# EAGLE design AllSerial (EAGLE 7.6.0)

## Sheet 1 of 6
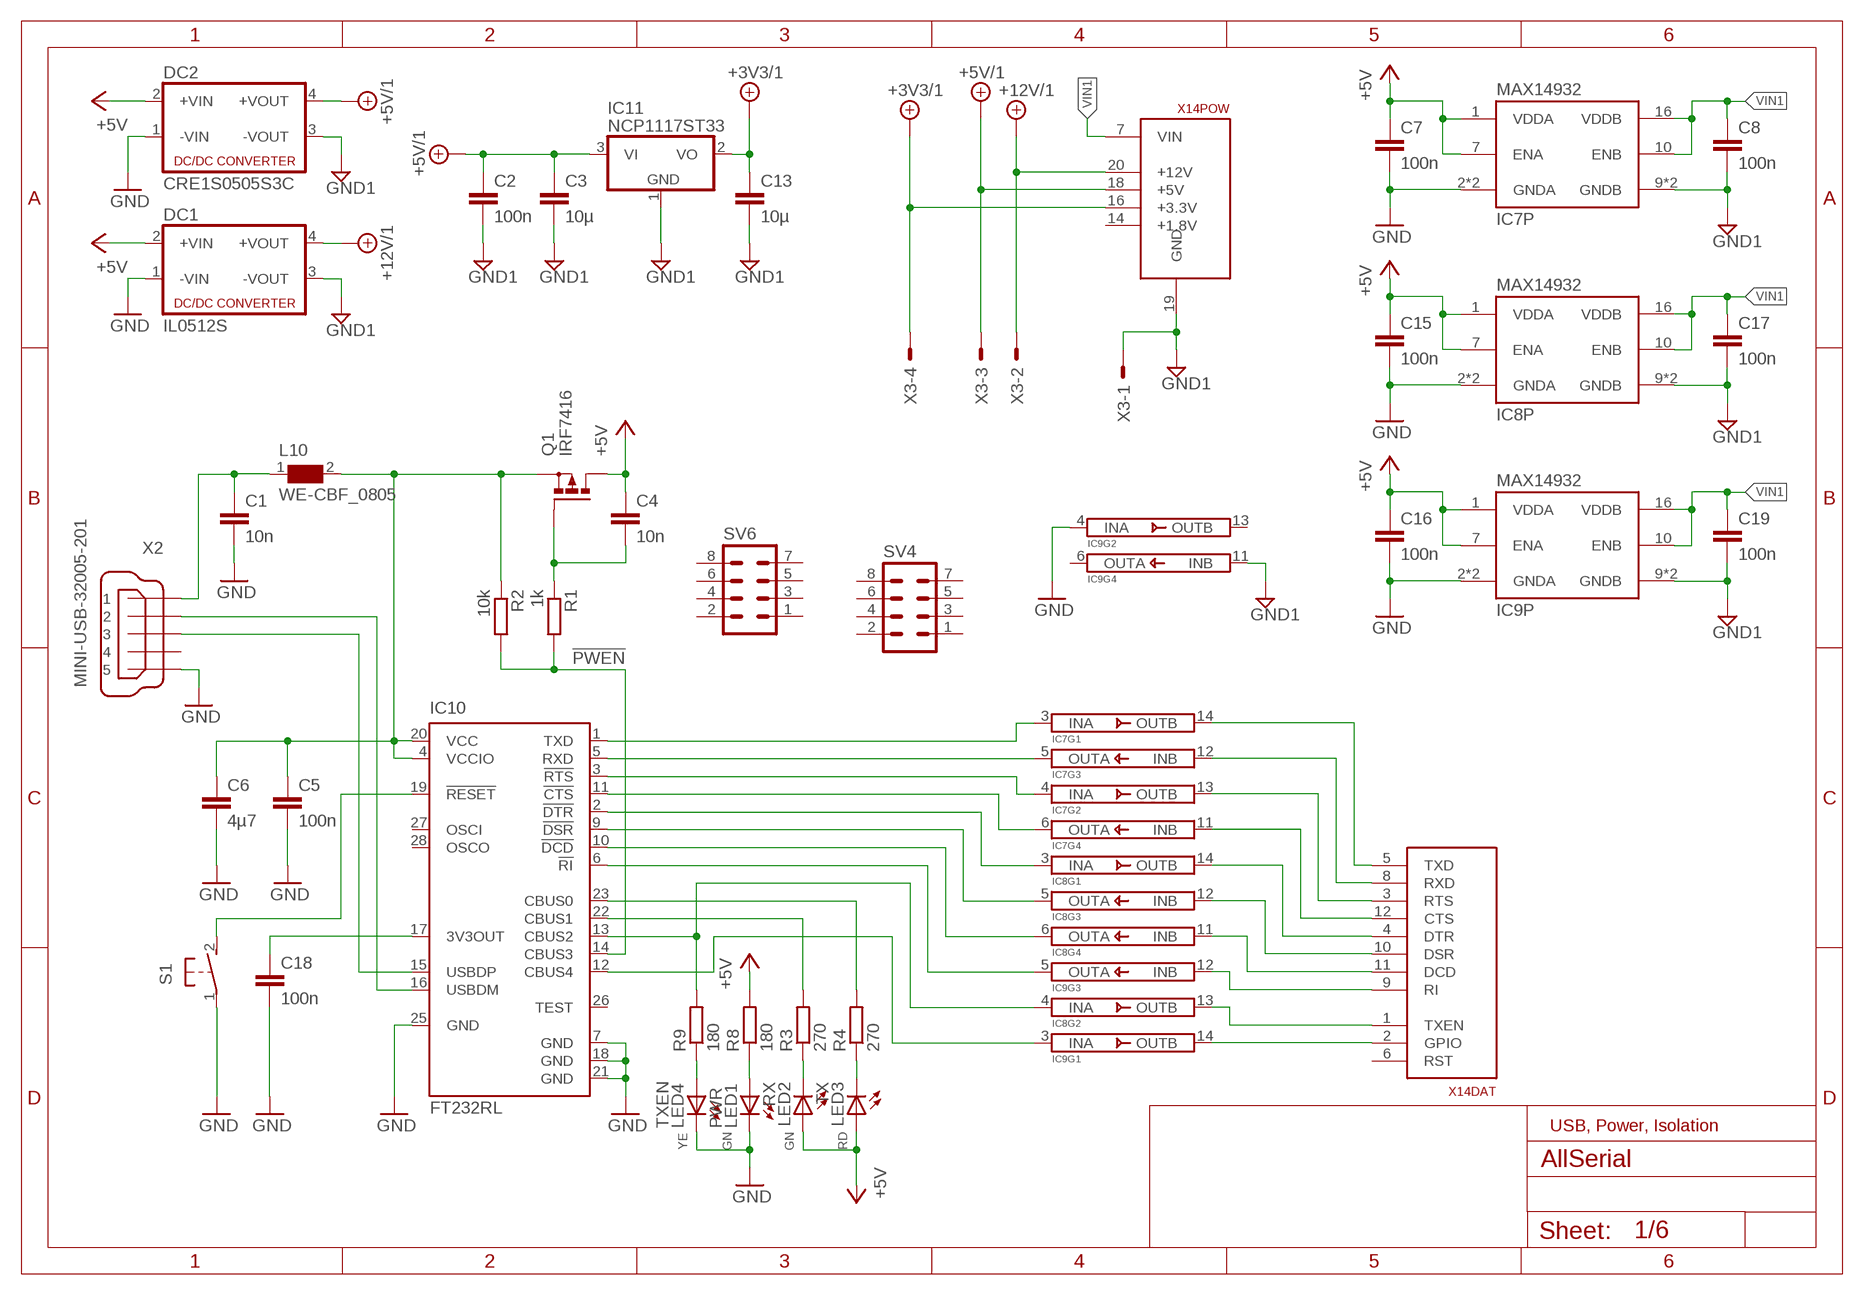
[diagram p0: schematic, sheet 1]

### Parts
C1  10n  C-EUC0805  [C0805]
C2  100n  C-EUC0805  [C0805]
C3  10µ  C-EUC0805  [C0805]
C4  10n  C-EUC0805  [C0805]
C5  100n  C-EUC0805  [C0805]
C6  4µ7  C-EUC0805  [C0805]
C7  100n  C-EUC0805  [C0805]
C8  100n  C-EUC0805  [C0805]
C13  10µ  C-EUC0805  [C0805]
C15  100n  C-EUC0805  [C0805]
C16  100n  C-EUC0805  [C0805]
C17  100n  C-EUC0805  [C0805]
C18  100n  C-EUC0805  [C0805]
C19  100n  C-EUC0805  [C0805]
DC1  IL0512S  NME  [NME]
DC2  CRE1S0505S3C  NME  [NME]
IC7  MAX14932  [SO16]
IC8  MAX14932  [SO16]
IC9  MAX14932  [SO16]
IC10  FT232RL  [SSOP28]
IC11  NCP1117ST33  MCP1703CB  [SOT23]
L10  WE-CBF_0805  [0805]
LED1  PWR  LEDCHIPLED_0805  [CHIPLED_0805]
LED2  RX  LEDCHIPLED_0805  [CHIPLED_0805]
LED3  TX  LEDCHIPLED_0805  [CHIPLED_0805]
LED4  TXEN  LEDCHIPLED_0805  [CHIPLED_0805]
Q1  IRF7416  P-MOSFET-SO8  [SO-08]
R1  1k  R-EU_R0805  [R0805]
R2  10k  R-EU_R0805  [R0805]
R3  270  R-EU_R0805  [R0805]
R4  270  R-EU_R0805  [R0805]
R8  180  R-EU_R0805  [R0805]
R9  180  R-EU_R0805  [R0805]
S1  31-XX  [B3F-31XX]
SV4  MA04-2  [MA04-2]
SV6  MA04-2  [MA04-2]
X2  MINI-USB-32005-201  [32005-201]
X3  AKL18X-04W  [AKL182-04]
X14  ALLSERIALMM  [MAIN-THT]

### Nets
!PWEN: IC10.14(CBUS3) R1.2 R2.2
+3V3/1: C13.1 IC11.2(VO) X3.P$4 X14.16(POW:+3.3V)
+5V: C4.1 C7.1 C15.1 C16.1 DC1.2(+VIN) DC2.2(+VIN) IC7.1(P:VDDA) IC7.7(P:ENA) IC8.1(P:VDDA) IC8.7(P:ENA) IC9.1(P:VDDA) IC9.7(P:ENA) LED2.A LED3.A Q1.5(D) Q1.6(D) Q1.7(D) Q1.8(D) R8.2
+5V/1: C2.1 C3.1 DC2.4(+VOUT) IC11.3(VI) X3.P$3 X14.18(POW:+5V)
+12V/1: DC1.4(+VOUT) X3.P$2 X14.20(POW:+12V)
GND: C1.2 C5.2 C6.2 C7.2 C15.2 C16.2 C18.2 DC1.1(-VIN) DC2.1(-VIN) IC7.2(P:GNDA) IC7.8(P:GNDA) IC8.2(P:GNDA) IC8.8(P:GNDA) IC9.2(P:GNDA) IC9.4(INA) IC9.8(P:GNDA) IC10.7(GND) IC10.18(GND) IC10.21(GND) IC10.25(GND) LED1.C LED4.C S1.1(P) X2.5
GND1: C2.2 C3.2 C8.2 C13.2 C17.2 C19.2 DC1.3(-VOUT) DC2.3(-VOUT) IC7.9(P:GNDB) IC7.15(P:GNDB) IC8.9(P:GNDB) IC8.15(P:GNDB) IC9.9(P:GNDB) IC9.11(INB) IC9.15(P:GNDB) IC11.1(GND) X3.P$1 X14.19(POW:GND)
N$3: IC8.4(INA) IC10.13(CBUS2) R9.2
N$4: LED3.C R4.1
N$5: IC10.19(!RESET) S1.2(S)
N$6: LED2.C R3.1
N$7: LED4.A R9.1
N$8: LED1.A R8.1
N$11: C1.1 L10.1 X2.1
N$13: IC9.3(INA) IC10.12(CBUS4)
N$14: IC7.3(INA) IC10.1(TXD)
N$19: IC10.16(USBDM) X2.2
N$20: IC7.5(OUTA) IC10.5(RXD)
N$21: IC10.15(USBDP) X2.3
N$22: C18.1 IC10.17(3V3OUT)
N$29: IC7.4(INA) IC10.3(!RTS)
N$32: IC7.6(OUTA) IC10.11(!CTS)
N$33: IC8.3(INA) IC10.2(!DTR)
N$34: IC8.5(OUTA) IC10.9(!DSR)
N$35: IC8.6(OUTA) IC10.10(!DCD)
N$36: IC9.5(OUTA) IC10.6(!RI)
N$38: C5.1 C6.1 IC10.4(VCCIO) IC10.20(VCC) L10.2 Q1.1(S) Q1.2(S) Q1.3(S) R2.1
N$42: C4.2 Q1.4(G) R1.1
N$80: IC7.14(OUTB) X14.5(DAT:TXD)
N$81: IC7.12(INB) X14.8(DAT:RXD)
N$82: IC7.13(OUTB) X14.3(DAT:RTS)
N$83: IC7.11(INB) X14.12(DAT:CTS)
N$84: IC8.14(OUTB) X14.4(DAT:DTR)
N$85: IC8.12(INB) X14.10(DAT:DSR)
N$86: IC8.11(INB) X14.11(DAT:DCD)
N$87: IC9.12(INB) X14.9(DAT:RI)
N$88: IC8.13(OUTB) X14.1(DAT:TXEN)
N$89: IC9.14(OUTB) X14.2(DAT:GPIO)
RXLED: IC10.22(CBUS1) R3.2
TXLED: IC10.23(CBUS0) R4.2
VIN1: C8.1 C17.1 C19.1 IC7.10(P:ENB) IC7.16(P:VDDB) IC8.10(P:ENB) IC8.16(P:VDDB) IC9.10(P:ENB) IC9.16(P:VDDB) X14.7(POW:VIN)
Unconnected: IC9.6(OUTA) IC9.13(OUTB) IC10.26(TEST) IC10.27(OSCI) IC10.28(OSCO) SV4.1 SV4.2 SV4.3 SV4.4 SV4.5 SV4.6 SV4.7 SV4.8 SV6.1 SV6.2 SV6.3 SV6.4 SV6.5 SV6.6 SV6.7 SV6.8 X2.4 X14.6(DAT:RST) X14.14(POW:+1.8V)

### Notes on the sheet
- USB, Power, Isolation

## Sheet 2 of 6
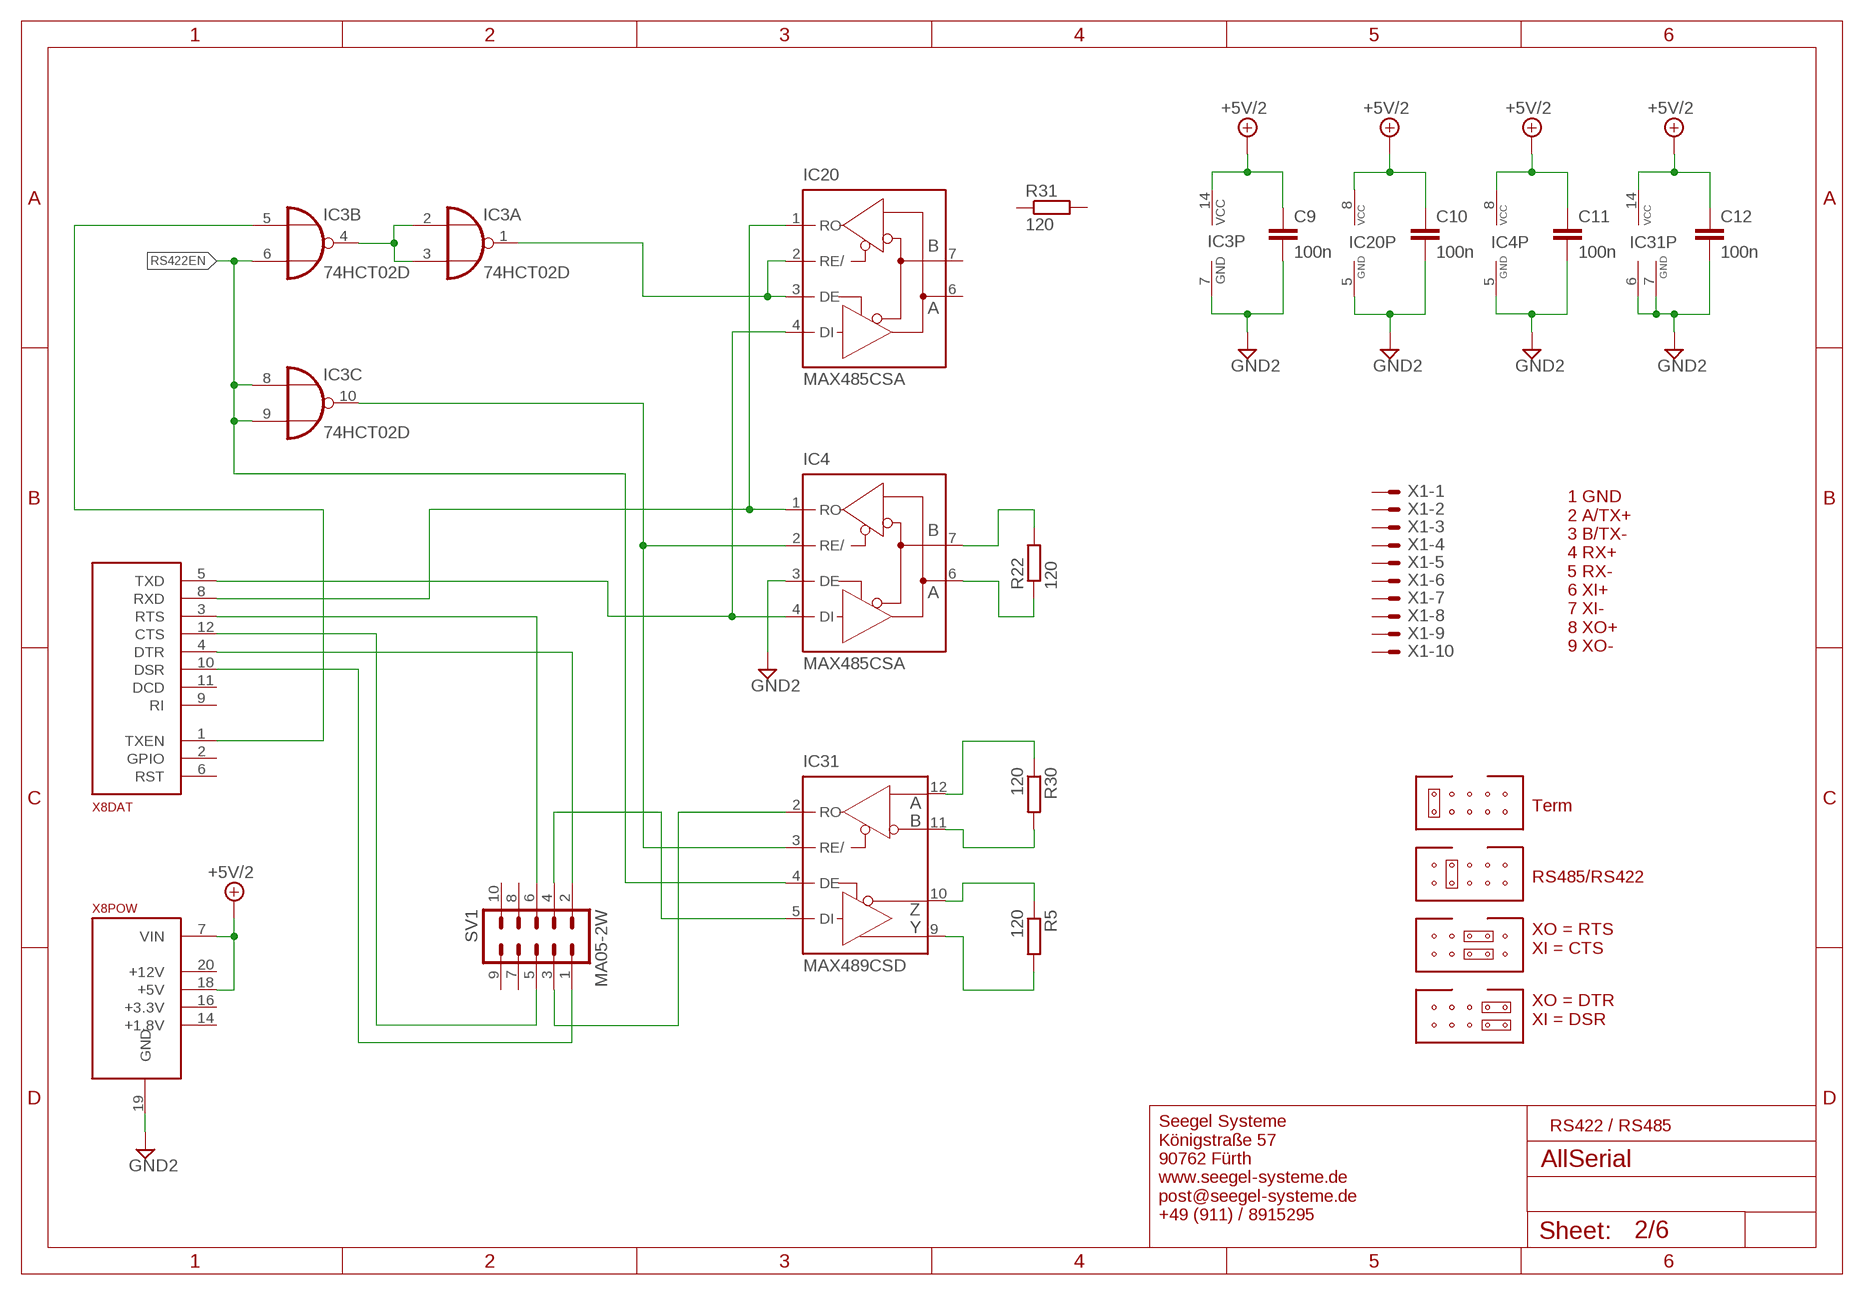
[diagram p1: schematic, sheet 2]

### Parts
C9  100n  C-EUC0805  [C0805]
C10  100n  C-EUC0805  [C0805]
C11  100n  C-EUC0805  [C0805]
C12  100n  C-EUC0805  [C0805]
IC3  74HCT02D  [SO14]
IC4  MAX485CSA  MAX481CSA  [SO08]
IC20  MAX485CSA  MAX481CSA  [SO08]
IC31  MAX489CSD  [SO14]
R5  120  R-EU_R0805  [R0805]
R22  120  R-EU_R0805  [R0805]
R30  120  R-EU_R0805  [R0805]
R31  120  R-EU_R0805  [R0805]
SV1  MA05-2W  [MA05-2W]
X1  AKL18X-10W  [AKL182-10]
X8  ALLSERIALD  [DAUGHTER-THT]

### Nets
+5V/2: C9.1 C10.1 C11.1 C12.1 IC3.14(P:VCC) IC4.8(VCC) IC20.8(VCC) IC31.14(VCC) X8.7(POW:VIN) X8.18(POW:+5V)
GND2: C9.2 C10.2 C11.2 C12.2 IC3.7(P:GND) IC4.3(DE) IC4.5(GND) IC20.5(GND) IC31.6(GND) IC31.7(GND) X8.19(POW:GND)
N$1: IC31.11(B) R30.2
N$2: IC31.10(Z) R5.1
N$10: IC31.9(Y) R5.2
N$37: IC3.5(B:I0) X8.1(DAT:TXEN)
N$39: IC31.12(A) R30.1
N$40: SV1.5 X8.12(DAT:CTS)
N$41: IC4.7(B) R22.2
N$43: IC4.6(A) R22.1
N$48: IC3.2(A:I0) IC3.3(A:I1) IC3.4(B:O)
N$50: IC3.1(A:O) IC20.2(RE/) IC20.3(DE)
N$51: IC3.10(C:O) IC4.2(RE/) IC31.3(RE/)
N$52: IC4.1(RO) IC20.1(RO) X8.8(DAT:RXD)
N$53: IC4.4(DI) IC20.4(DI) X8.5(DAT:TXD)
N$66: SV1.6 X8.3(DAT:RTS)
N$67: SV1.2 X8.4(DAT:DTR)
N$68: IC31.5(DI) SV1.4
N$69: IC31.2(RO) SV1.3
N$70: SV1.1 X8.10(DAT:DSR)
RS422EN: IC3.6(B:I1) IC3.8(C:I0) IC3.9(C:I1) IC31.4(DE)
Unconnected: IC3.11(D:I0) IC3.12(D:I1) IC3.13(D:O) IC20.6(A) IC20.7(B) IC31.1(NC) IC31.8(NC) IC31.13(NC) R31.1 R31.2 SV1.7 SV1.8 SV1.9 SV1.10 X1.P$1 X1.P$2 X1.P$3 X1.P$4 X1.P$5 X1.P$6 X1.P$7 X1.P$8 X1.P$9 X1.P$10 X8.2(DAT:GPIO) X8.6(DAT:RST) X8.9(DAT:RI) X8.11(DAT:DCD) X8.14(POW:+1.8V) X8.16(POW:+3.3V) X8.20(POW:+12V)

### Notes on the sheet
- 1 GND
  2 A/TX+
  3 B/TX-
  4 RX+
  5 RX-
  6 XI+
  7 XI-
  8 XO+
  9 XO-
- Term
- RS485/RS422
- XO = RTS
  XI = CTS
- XO = DTR
  XI = DSR
- RS422 / RS485
- Seegel Systeme
  Königstraße 57
  90762 Fürth
  www.seegel-systeme.de
  post@seegel-systeme.de
  +49 (911) / 8915295

## Sheet 3 of 6
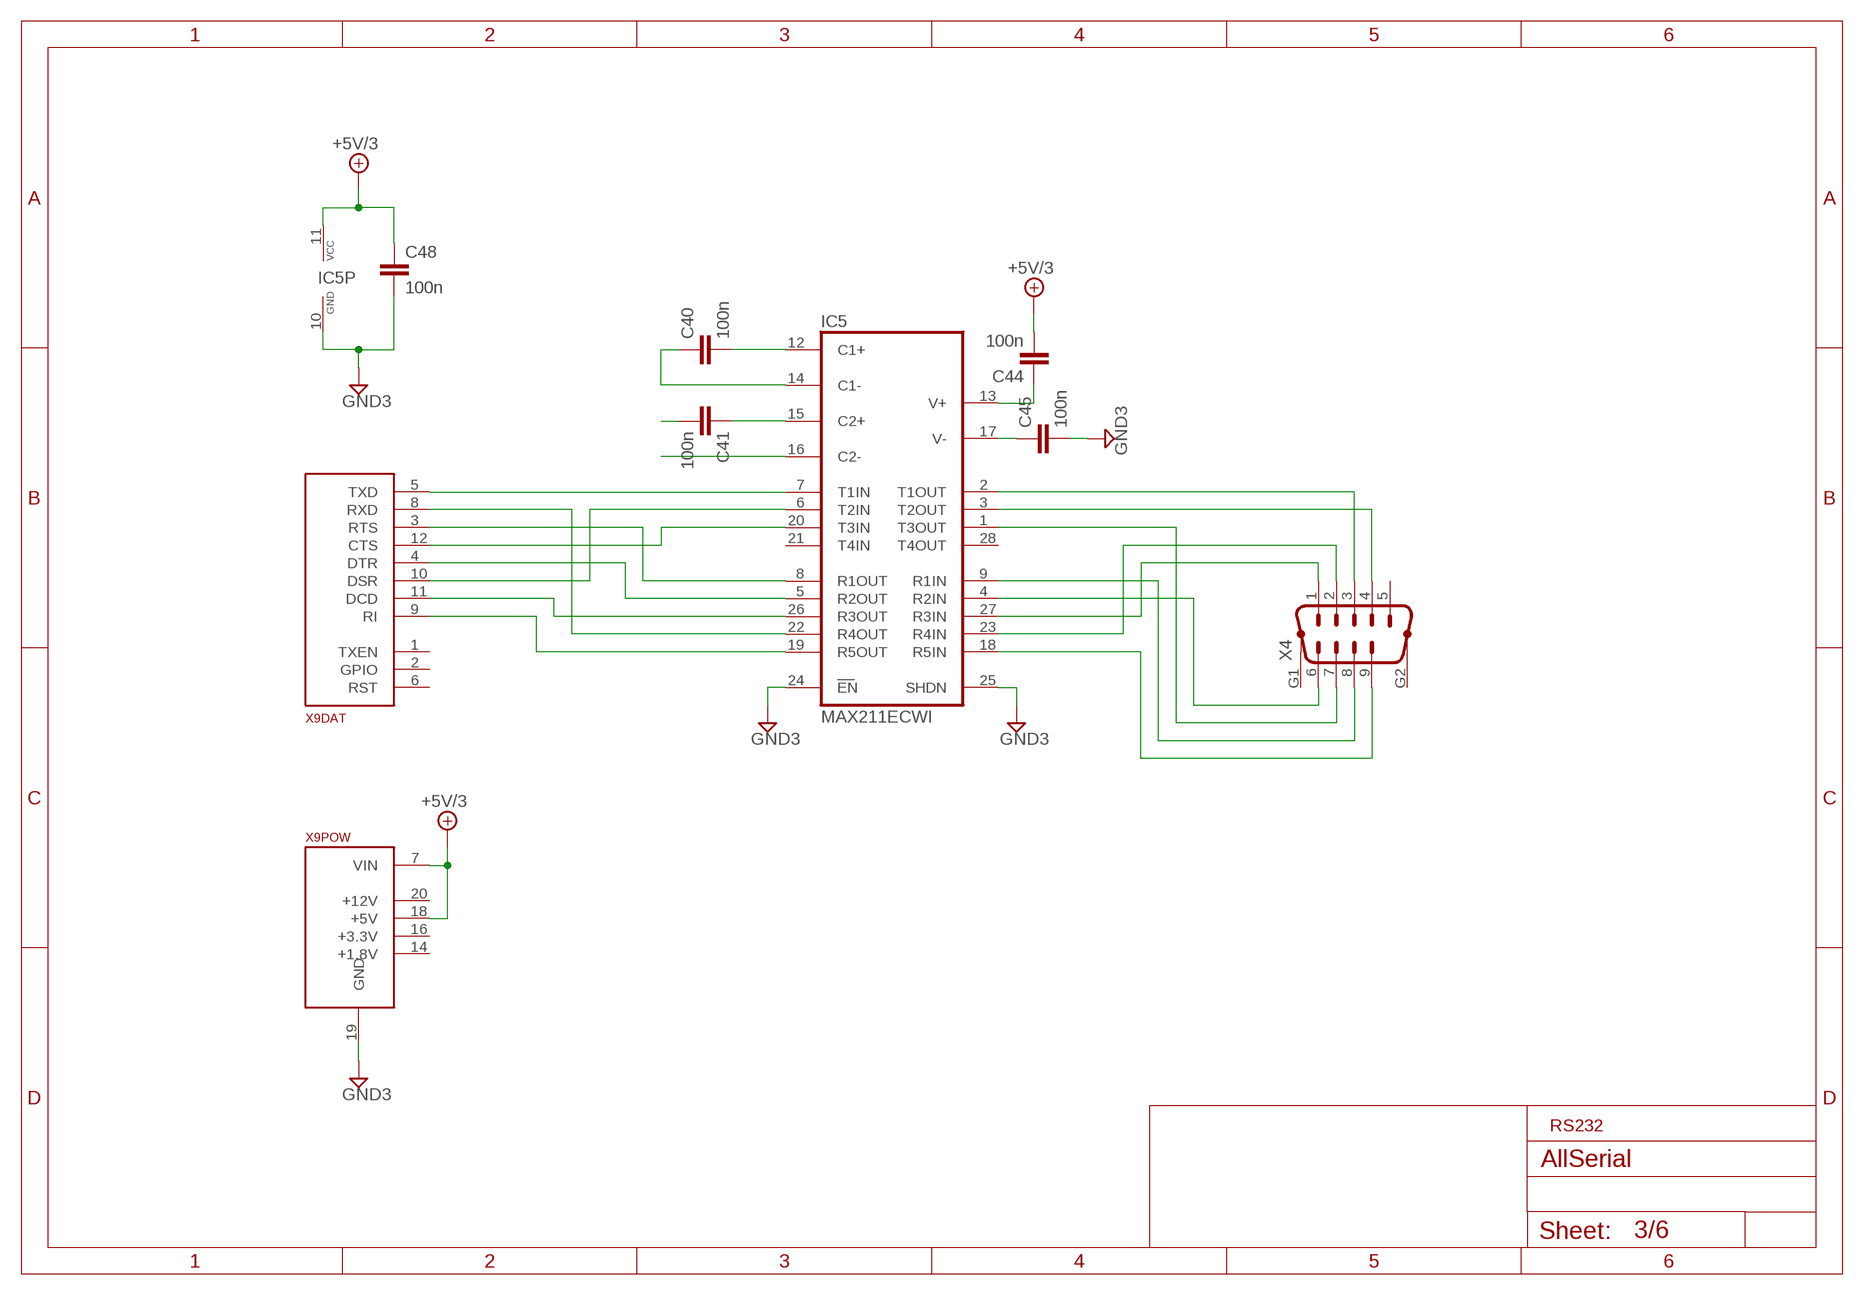
[diagram p2: schematic, sheet 3]

### Parts
C40  100n  C-EUC0805  [C0805]
C41  100n  C-EUC0805  [C0805]
C44  100n  C-EUC0805  [C0805]
C45  100n  C-EUC0805  [C0805]
C48  100n  C-EUC0805  [C0805]
IC5  MAX211ECWI  [SO28L]
X4  M09HP  [M09HP]
X9  ALLSERIALD  [DAUGHTER-THT]

### Nets
+5V/3: C44.2 C48.1 IC5.11(VCC) X9.7(POW:VIN) X9.18(POW:+5V)
GND3: C45.2 C48.2 IC5.10(GND) IC5.24(EN) IC5.25(SHDN) X9.19(POW:GND)
N$9: IC5.18(R5IN) X4.9
N$12: IC5.9(R1IN) X4.8
N$15: IC5.1(T3OUT) X4.7
N$16: IC5.4(R2IN) X4.6
N$17: IC5.27(R3IN) X4.1
N$18: IC5.23(R4IN) X4.2
N$23: IC5.2(T1OUT) X4.3
N$24: IC5.3(T2OUT) X4.4
N$25: C40.2 IC5.12(C1+)
N$26: C40.1 IC5.14(C1-)
N$27: C41.1 IC5.15(C2+)
N$28: IC5.16(C2-)
N$30: C45.1 IC5.17(V-)
N$31: C44.1 IC5.13(V+)
N$92: C41.2
N$93: IC5.7(T1IN) X9.5(DAT:TXD)
N$94: IC5.22(R4OUT) X9.8(DAT:RXD)
N$95: IC5.20(T3IN) X9.12(DAT:CTS)
N$96: IC5.8(R1OUT) X9.3(DAT:RTS)
N$97: IC5.26(R3OUT) X9.11(DAT:DCD)
N$98: IC5.19(R5OUT) X9.9(DAT:RI)
N$99: IC5.5(R2OUT) X9.4(DAT:DTR)
N$100: IC5.6(T2IN) X9.10(DAT:DSR)
Unconnected: IC5.21(T4IN) IC5.28(T4OUT) X4.5 X4.G1 X4.G2 X9.1(DAT:TXEN) X9.2(DAT:GPIO) X9.6(DAT:RST) X9.14(POW:+1.8V) X9.16(POW:+3.3V) X9.20(POW:+12V)

### Notes on the sheet
- RS232

## Sheet 4 of 6
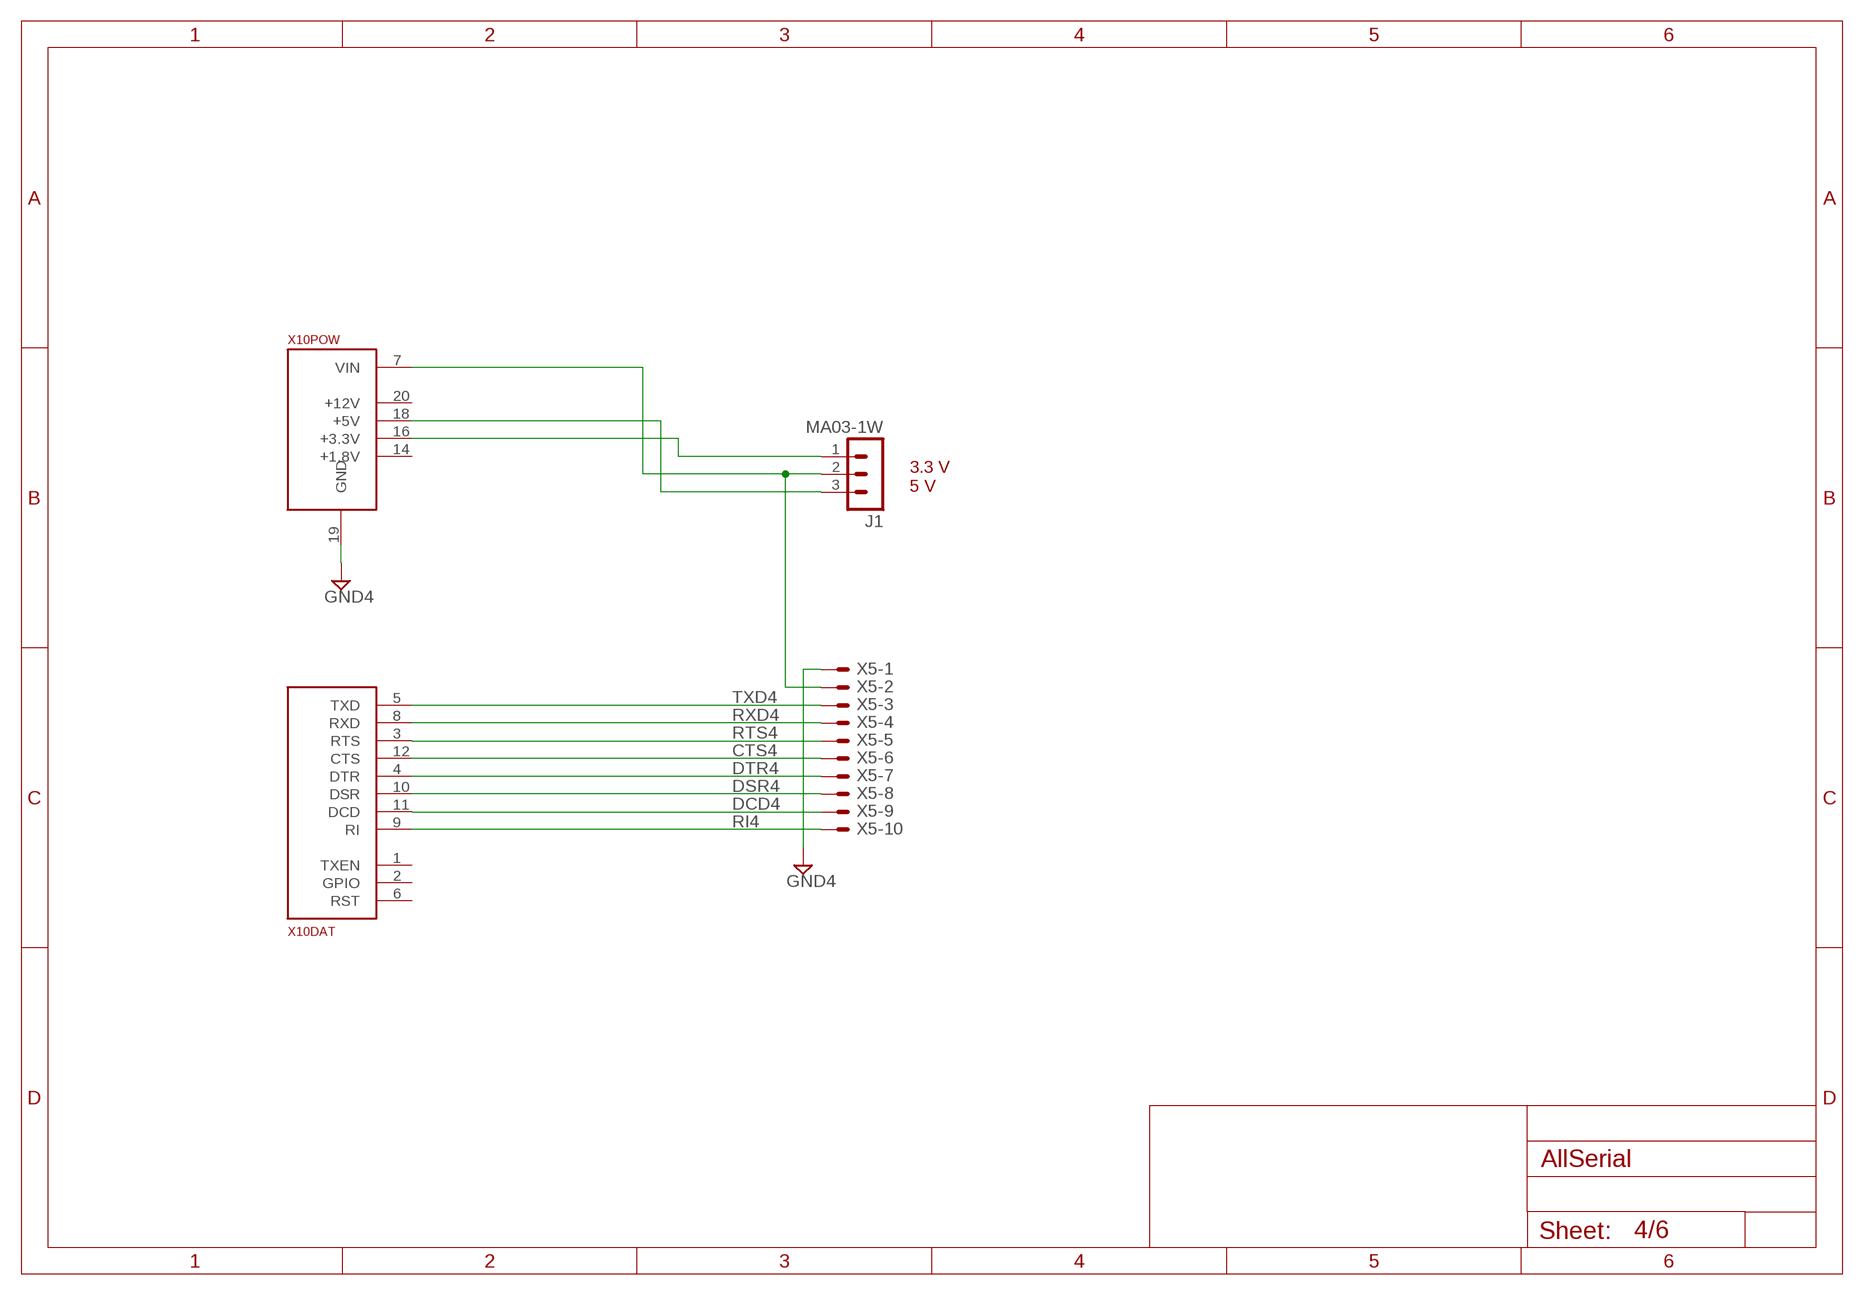
[diagram p3: schematic, sheet 4]

### Parts
J1  MA03-1W  [MA03-1W]
X5  AKL18X-10W  [AKL182-10]
X10  ALLSERIALD  [DAUGHTER-THT]

### Nets
CTS4: X5.P$6 X10.12(DAT:CTS)
DCD4: X5.P$9 X10.11(DAT:DCD)
DSR4: X5.P$8 X10.10(DAT:DSR)
DTR4: X5.P$7 X10.4(DAT:DTR)
GND4: X5.P$1 X10.19(POW:GND)
N$47: J1.1 X10.16(POW:+3.3V)
N$71: J1.3 X10.18(POW:+5V)
N$90: J1.2 X5.P$2 X10.7(POW:VIN)
RI4: X5.P$10 X10.9(DAT:RI)
RTS4: X5.P$5 X10.3(DAT:RTS)
RXD4: X5.P$4 X10.8(DAT:RXD)
TXD4: X5.P$3 X10.5(DAT:TXD)
Unconnected: X10.1(DAT:TXEN) X10.2(DAT:GPIO) X10.6(DAT:RST) X10.14(POW:+1.8V) X10.20(POW:+12V)

### Notes on the sheet
- 3.3 V
  5 V

## Sheet 5 of 6
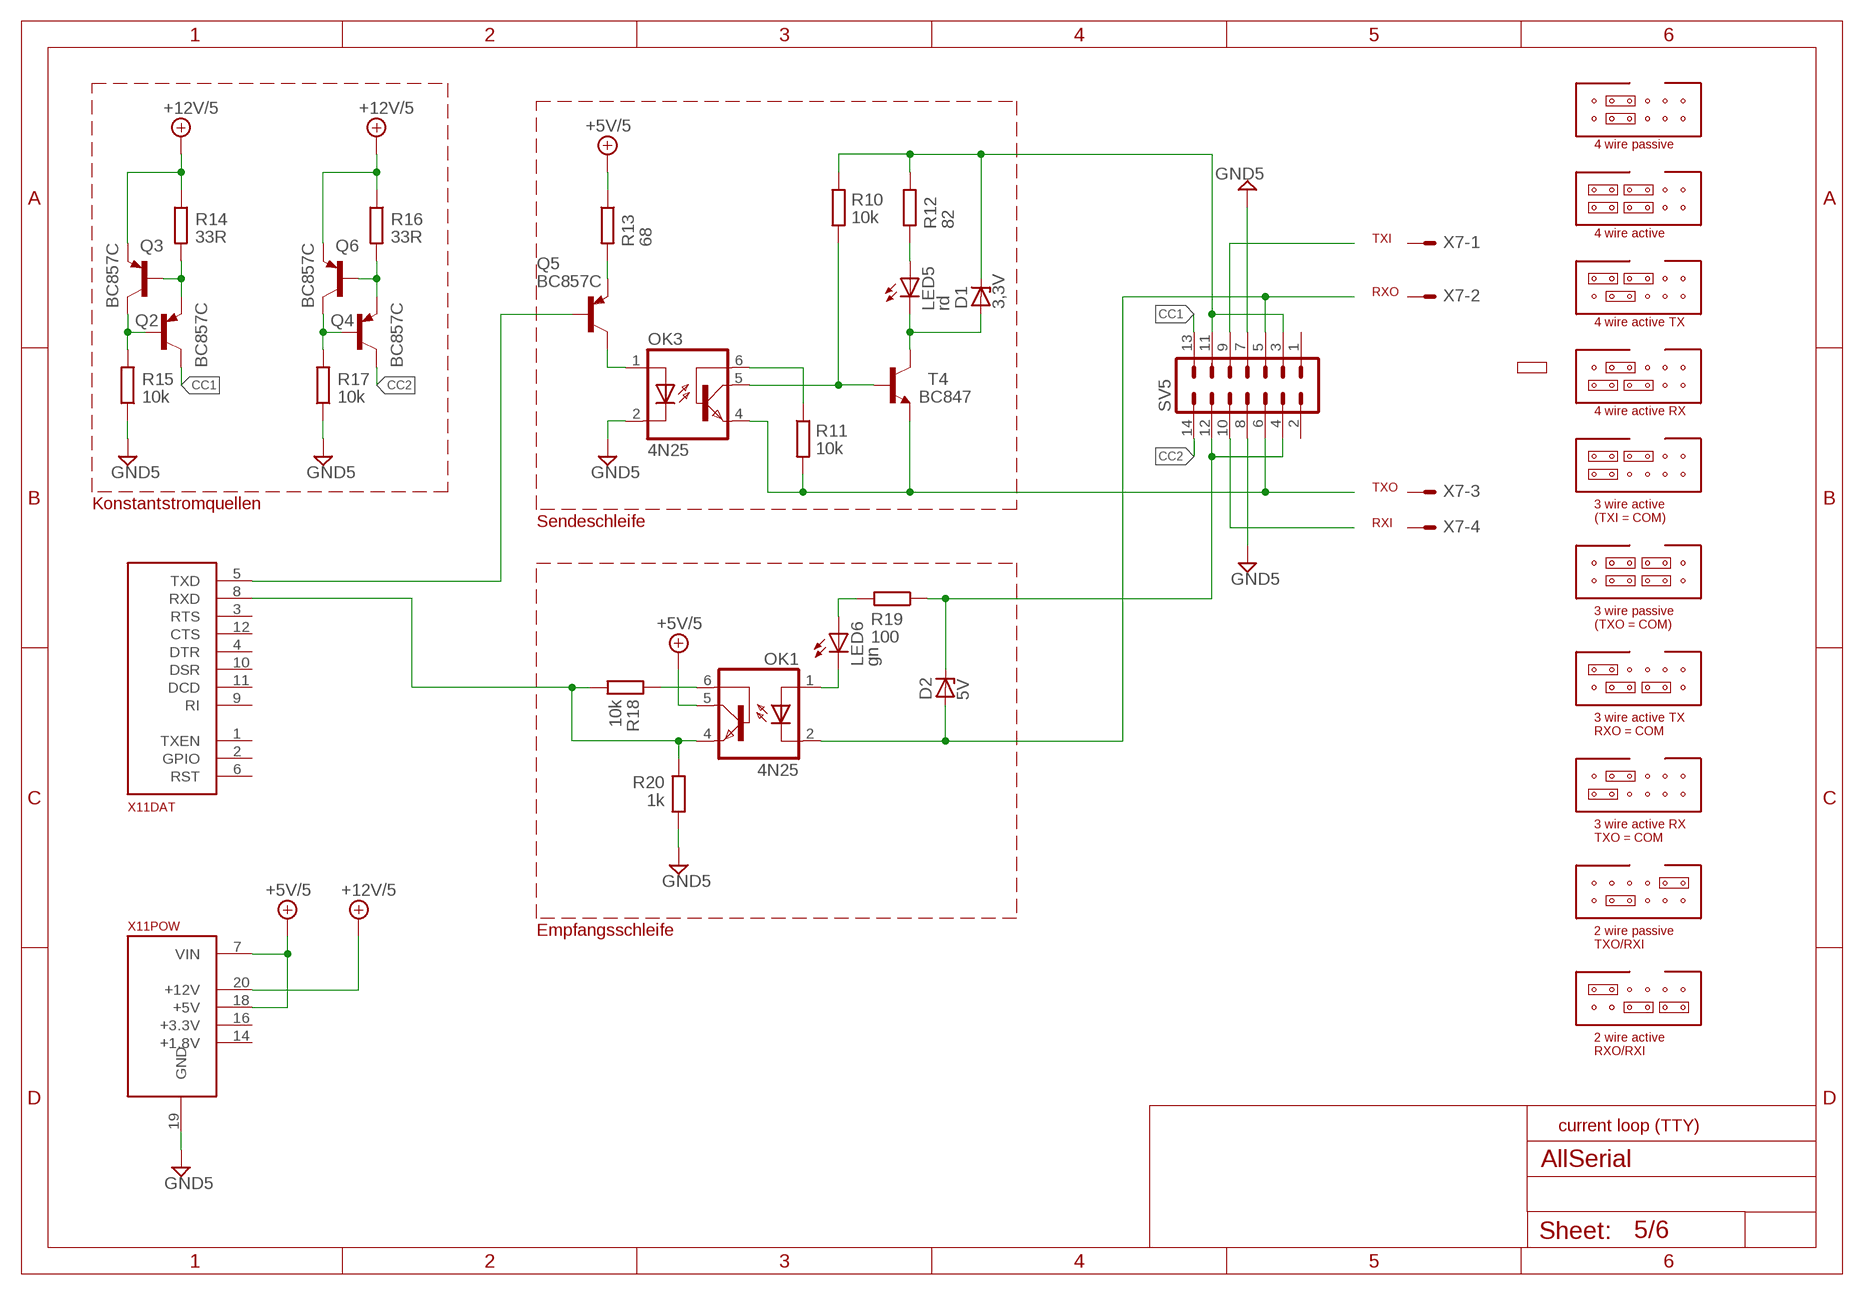
[diagram p4: schematic, sheet 5]

### Parts
D1  3,3V  ZENER-DIODESOT23  [SOT23]
D2  5V  ZENER-DIODESOT23  [SOT23]
LED5  rd  LEDCHIPLED_0603  [CHIPLED_0603]
LED6  gn  LEDCHIPLED_0603  [CHIPLED_0603]
OK1  4N25  4N35  [DIL06]
OK3  4N25  4N35  [DIL06]
Q2  BC857C  BC857CSMD  [SOT23-BEC]
Q3  BC857C  BC857CSMD  [SOT23-BEC]
Q4  BC857C  BC857CSMD  [SOT23-BEC]
Q5  BC857C  BC857CSMD  [SOT23-BEC]
Q6  BC857C  BC857CSMD  [SOT23-BEC]
R10  10k  R-EU_R0805  [R0805]
R11  10k  R-EU_R0805  [R0805]
R12  82  R-EU_R0805  [R0805]
R13  68  R-EU_R0805  [R0805]
R14  33R  R-EU_R0805  [R0805]
R15  10k  R-EU_R0805  [R0805]
R16  33R  R-EU_R0805  [R0805]
R17  10k  R-EU_R0805  [R0805]
R18  10k  R-EU_R0805  [R0805]
R19  100  R-EU_R0805  [R0805]
R20  1k  R-EU_R0805  [R0805]
SV5  ML14L  [ML14L]
T4  BC847  [SOT23]
X7  AKL18X-04W  [AKL182-04]
X11  ALLSERIALD  [DAUGHTER-THT]

### Nets
+5V/5: OK1.5(COL) R13.1 X11.7(POW:VIN) X11.18(POW:+5V)
+12V/5: Q3.E Q6.E R14.1 R16.1 X11.20(POW:+12V)
CC1: Q2.C SV5.13
CC2: Q4.C SV5.14
GND5: OK3.2(C) R15.1 R17.1 R20.1 SV5.7 SV5.8 X11.19(POW:GND)
N$44: SV5.9
N$45: Q4.B Q6.C R17.2
N$46: OK1.4(EMI) R18.2 R20.2 X11.8(DAT:RXD)
N$49: Q4.E Q6.B R16.2
N$54: OK3.6(BAS) R11.1
N$55: OK3.5(COL) R10.2 T4.1(B)
N$56: D1.1(A) LED5.C T4.3(C)
N$57: Q2.B Q3.C R15.2
N$58: LED5.A R12.2
N$59: Q2.E Q3.B R14.2
N$60: OK3.1(A) Q5.C
N$61: Q5.E R13.2
N$62: OK1.6(BAS) R18.1
N$63: LED6.C OK1.1(A)
N$64: LED6.A R19.2
N$65: SV5.10
N$91: Q5.B X11.5(DAT:TXD)
RXN: D2.1(A) OK1.2(C) SV5.5
RXP: D2.3(C) R19.1 SV5.4 SV5.12
TXN: OK3.4(EMI) R11.2 SV5.6 T4.2(E)
TXP: D1.3(C) R10.1 R12.1 SV5.3 SV5.11
Unconnected: SV5.1 SV5.2 X7.P$1 X7.P$2 X7.P$3 X7.P$4 X11.1(DAT:TXEN) X11.2(DAT:GPIO) X11.3(DAT:RTS) X11.4(DAT:DTR) X11.6(DAT:RST) X11.9(DAT:RI) X11.10(DAT:DSR) X11.11(DAT:DCD) X11.12(DAT:CTS) X11.14(POW:+1.8V) X11.16(POW:+3.3V)

### Notes on the sheet
- 4 wire passive
- 4 wire active
- TXI
- RXO
- 4 wire active TX
- 4 wire active RX
- TXO
- Konstantstromquellen
- 3 wire active
  (TXI = COM)
- Sendeschleife | RXI
- 3 wire passive
  (TXO = COM)
- 3 wire active TX
  RXO = COM
- 3 wire active RX
  TXO = COM
- Empfangsschleife
- 2 wire passive
  TXO/RXI
- 2 wire active
  RXO/RXI
- current loop (TTY)

## Sheet 6 of 6
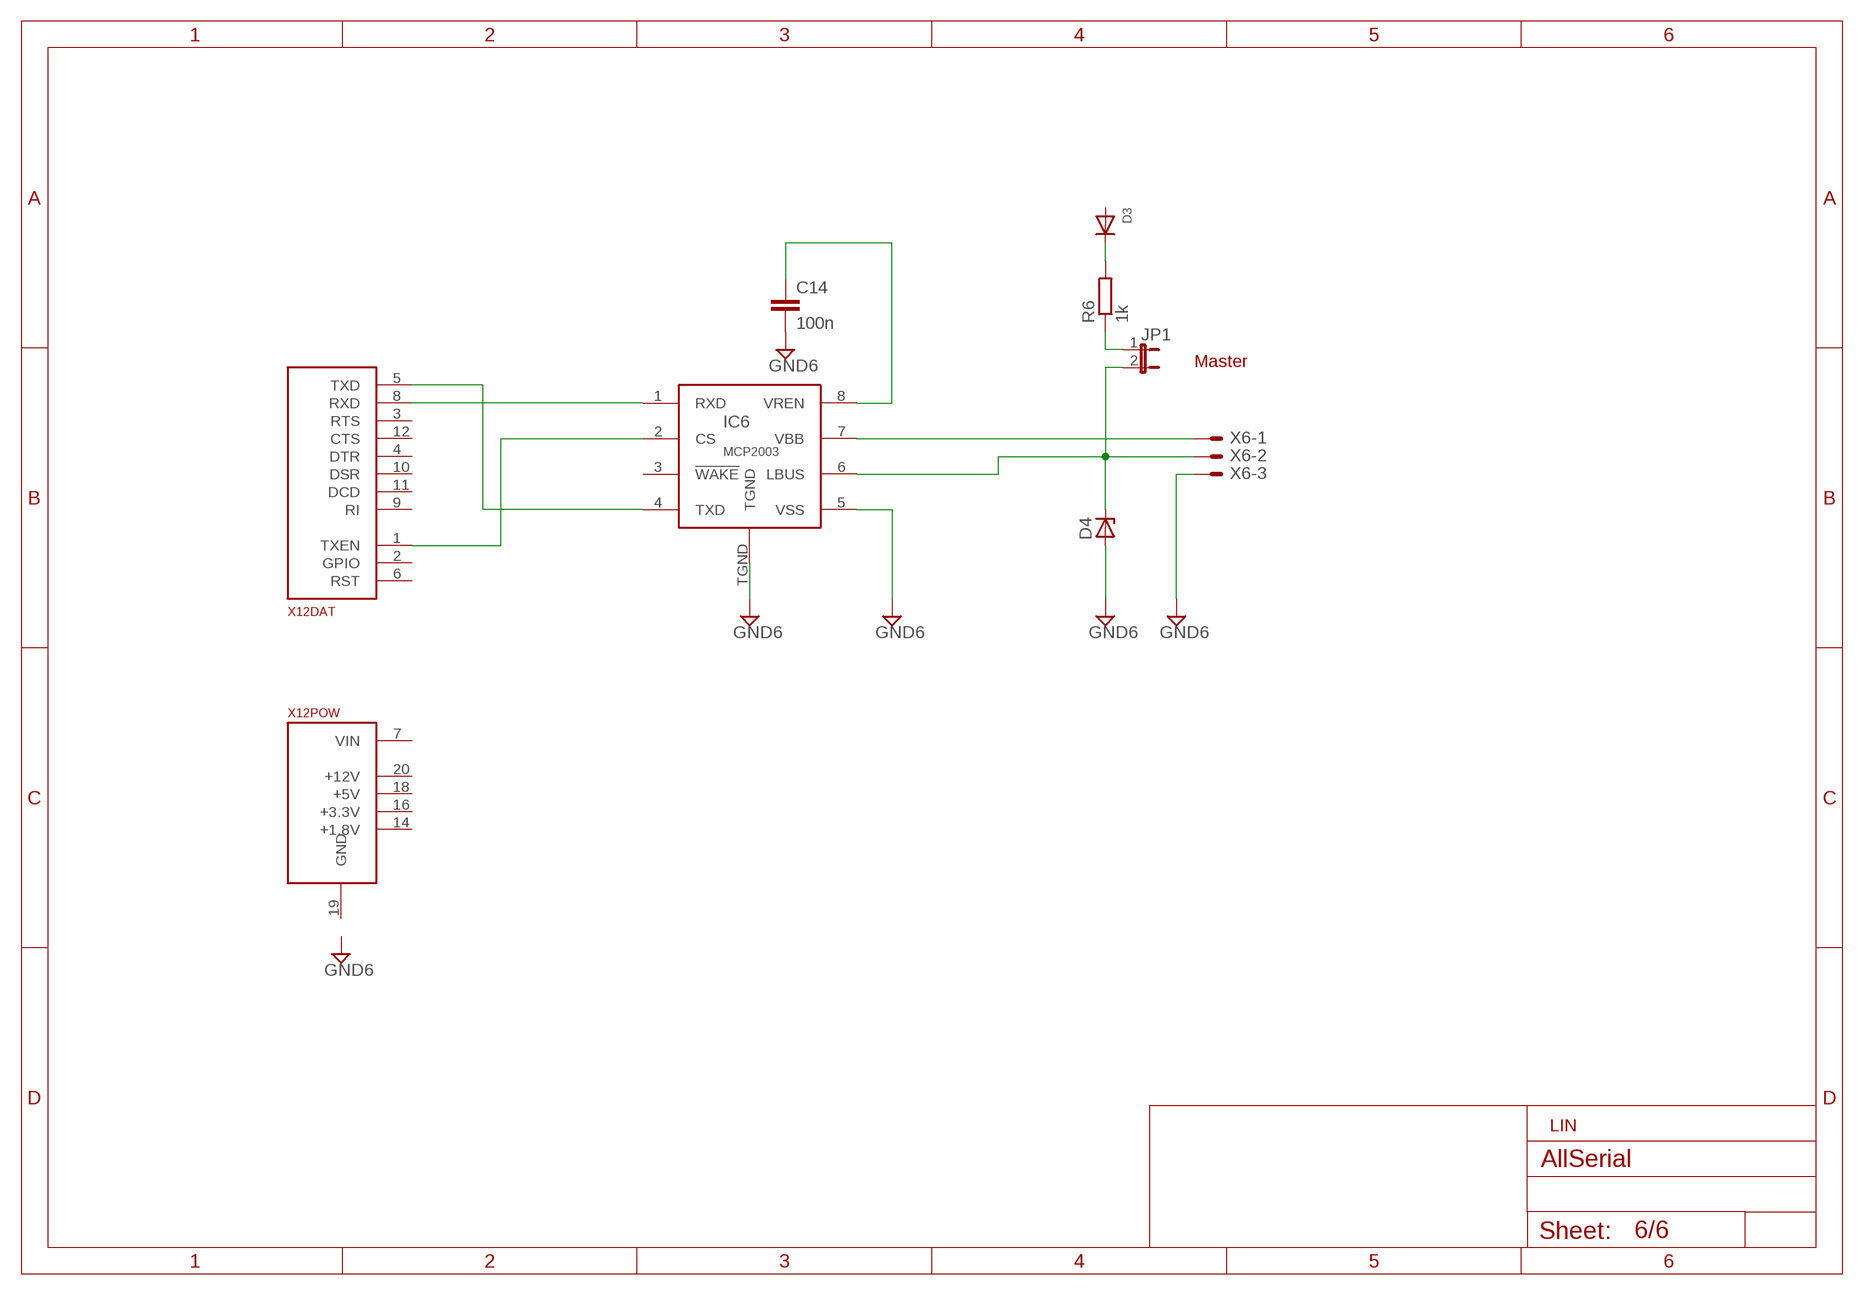
[diagram p5: schematic, sheet 6]

### Parts
C14  100n  C-EUC0805  [C0805]
D3  DIODESOD-123  [SOD-123]
D4  ZENER-DIODESOT23  [SOT23]
IC6  MCP2003  [SOIC8T]
JP1  JP1E  [JP1]
R6  1k  R-EU_R0805  [R0805]
X6  AKL18X-03W  [AKL182-03]
X12  ALLSERIALD  [DAUGHTER-THT]

### Nets
GND6: C14.2 D4.1(A) IC6.5(VSS) IC6.TGND X6.P$3
N$72: IC6.7(VBB) X6.P$1
N$73: D4.3(C) IC6.6(LBUS) JP1.2 X6.P$2
N$74: JP1.1 R6.1
N$75: D3.C R6.2
N$76: C14.1 IC6.8(VREN)
N$77: IC6.4(TXD) X12.5(DAT:TXD)
N$78: IC6.2(CS) X12.1(DAT:TXEN)
N$79: IC6.1(RXD) X12.8(DAT:RXD)
Unconnected: D3.A IC6.3(!WAKE) X12.2(DAT:GPIO) X12.3(DAT:RTS) X12.4(DAT:DTR) X12.6(DAT:RST) X12.7(POW:VIN) X12.9(DAT:RI) X12.10(DAT:DSR) X12.11(DAT:DCD) X12.12(DAT:CTS) X12.14(POW:+1.8V) X12.16(POW:+3.3V) X12.18(POW:+5V) X12.19(POW:GND) X12.20(POW:+12V)

### Notes on the sheet
- Master
- LIN

## Library data of the parts
C1-C19 C40 C41 C44 C45 C48 = rcl:C-EU: CAPACITOR, European symbol
D1 D2 D4 = diode:ZENER-DIODE: Z-Diode
D3 = microbuilder:DIODE: Diode SMA Model Volts Amps Type Vf Vr Digikey # Notes SSA34-E3 40V 3A Schottky 480mV @ 3A 200uA @ 40V SSA34-E3/61TGITR-ND CDBA120-G 20V 1A Schottky 500mV @ 1A 500uA @ 20V 641-1014-6-ND REEL MBRA210 10V 2A Schottky 350mV @ 2A 700uA @ 10V MBRA210LT3 SOD-123 Model Volts Amps Type Vf Vr Order # Notes BAT54T1G 30V 200mA Schottky 800mV @ 200mA 2uA @ 25V BAT54T1GOSTR-ND B0530W 30V 500mA Schottky 430mV @ 500mA 130uA @ 30V B0530W-FDICT-ND REEL MBR120 1A 20V Schottky 340mV @ 1A MBR120VLSFT1GOSCT-ND SOD-323 Model Volts Amps Type Vf Vr Order # Notes PMEG2005EJ 20V 500mA Schottky 355mV @ 500mA 568-4110-1-ND ZLLS410 10V 570mA Schottky 380mV @ 570mA ZLLS410CT-ND 1N4148WS 75V 150mA Silicon/Simple 1V 1N4148WSFSCT-ND REEL SOD-523 Model Volts Amps Type Vf Vr Order # Notes BAT54XV2 30V 200mA Schottky 0.8V @ 100mA BAT54XV2CT-ND TB751S 30V 30mA Schottky RB751S-40TE61CT-ND SOT23-R/W (R = Solder Paste/Reflow Ovens, W = Hand-Soldering) Model Volts Amps Type Vf Vr Order # Notes BAT54FILM 40V 300mA Schottky 497-7162-1-ND
DC1 DC2 = dc-dc-converter:NME: DC-DC CONVERTER; MF: C & D TECHNOLOGIES, INC; MPN: NME1205D; OC_FARNELL: 1021466; OC_NEWARK: 98B8198
IC3 = 74xx-eu:74*02: Quad 2-input NOR gate
IC4 IC20 = maxim:MAX481CSA: RS485 TRANSEIVER; MF: MAXIM; MPN: MAX481CSA; OC_FARNELL: unknown; OC_NEWARK: 90C3817
IC5 = maxim:MAX211ECWI: RS232 TRANSCEIVER; MPN: MAX211ECWI+T; OC_FARNELL: unknown; OC_NEWARK: 67K4400
IC6 = freetronics-jon:MCP2003
IC7-IC9 = max14932:MAX14932
IC10 = ftdichip:FT232R: Source: http://www.ftdichip.com/Documents/DataSheets/DS_FT232R_v104.pdf; MPN: FT232RL; OC_FARNELL: 1146032; OC_NEWARK: 91K9918
IC11 = linear:MCP1703: 250 mA, 16V, Low Quiescent Current LDO Regulator Source: http://ww1.microchip.com/downloads/en/DeviceDoc/22049b.pdf
IC31 = maxim:MAX489CSD: RS485 TRANSEIVER; MF: MAXIM; MPN: MAX489CSD; OC_FARNELL: 9724559; OC_NEWARK: 34C3923
J1 = con-lstb:MA03-1W
JP1 = jumper:JP1E: JUMPER
L10 = EagleLibrary_Wuerth_Elektronik_eiSos_Version_6-12:WE-CBF: SMD EMI Suppression Ferrite Beads WE-CBF - Excellent anti-EMI properties - Low DC-restistance - Impedances till 3000 ohms - Rated current up to 6 A -- Reliable Ni-Sn electrodes -- Perfect as data lined filter and for uncoupling of distribution voltage
LED1 LED2 = led:LED: LED OSRAM: - CHIPLED LG R971, LG N971, LY N971, LG Q971, LY Q971, LO R971, LY R971 LH N974, LH R974 LS Q976, LO Q976, LY Q976 LO Q996 - Hyper CHIPLED LW Q18S LB Q993, LB Q99A, LB R99A - SideLED LS A670, LO A670, LY A670, LG A670, LP A670 LB A673, LV A673, LT A673, LW A673 LH A674 LY A675 LS A676, LA A676, LO A676, LY A676, LW A676 LS A679, LY A679, LG A679 - Hyper Micro SIDELED® LS Y876, LA Y876, LO Y876, LY Y876 LT Y87S - SmartLED LW L88C, LW L88S LB L89C, LB L89S, LG L890 LS L89K, LO L89K, LY L89K LS L896, LA L896, LO L896, LY L896 - TOPLED LS T670, LO T670, LY T670, LG T670, LP T670 LSG T670, LSP T670, LSY T670, LOP T670, LYG T670 LG T671, LOG T671, LSG T671 LB T673, LV T673, LT T673, LW T673 LH T674 LS T676, LA T676, LO T676, LY T676, LB T676, LH T676, LSB T676, LW T676 LB T67C, LV T67C, LT T67C, LS T67K, LO T67K, LY T67K, LW E67C LS E67B, LA E67B, LO E67B, LY E67B, LB E67C, LV E67C, LT E67C LW T67C LS T679, LY T679, LG T679 LS T770, LO T770, LY T770, LG T770, LP T770 LB T773, LV T773, LT T773, LW T773 LH T774 LS E675, LA E675, LY E675, LS T675 LS T776, LA T776, LO T776, LY T776, LB T776 LHGB T686 LT T68C, LB T68C - Hyper Mini TOPLED® LB M676 - Mini TOPLED Santana® LG M470 LS M47K, LO M47K, LY M47K Source: http://www.osram.convergy.de LUXEON: - LUMILED® LXK2-PW12-R00, LXK2-PW12-S00, LXK2-PW14-U00, LXK2-PW14-V00 LXK2-PM12-R00, LXK2-PM12-S00, LXK2-PM14-U00 LXK2-PE12-Q00, LXK2-PE12-R00, LXK2-PE12-S00, LXK2-PE14-T00, LXK2-PE14-U00 LXK2-PB12-K00, LXK2-PB12-L00, LXK2-PB12-M00, LXK2-PB14-N00, LXK2-PB14-P00, LXK2-PB14-Q00 LXK2-PR12-L00, LXK2-PR12-M00, LXK2-PR14-Q00, LXK2-PR14-R00 LXK2-PD12-Q00, LXK2-PD12-R00, LXK2-PD12-S00 LXK2-PH12-R00, LXK2-PH12-S00 LXK2-PL12-P00, LXK2-PL12-Q00, LXK2-PL12-R00 Source: www.luxeon.com KINGBRIGHT: KA-3528ASYC Source: www.kingbright.com; COLOR: GN
LED3 = led:LED: LED OSRAM: - CHIPLED LG R971, LG N971, LY N971, LG Q971, LY Q971, LO R971, LY R971 LH N974, LH R974 LS Q976, LO Q976, LY Q976 LO Q996 - Hyper CHIPLED LW Q18S LB Q993, LB Q99A, LB R99A - SideLED LS A670, LO A670, LY A670, LG A670, LP A670 LB A673, LV A673, LT A673, LW A673 LH A674 LY A675 LS A676, LA A676, LO A676, LY A676, LW A676 LS A679, LY A679, LG A679 - Hyper Micro SIDELED® LS Y876, LA Y876, LO Y876, LY Y876 LT Y87S - SmartLED LW L88C, LW L88S LB L89C, LB L89S, LG L890 LS L89K, LO L89K, LY L89K LS L896, LA L896, LO L896, LY L896 - TOPLED LS T670, LO T670, LY T670, LG T670, LP T670 LSG T670, LSP T670, LSY T670, LOP T670, LYG T670 LG T671, LOG T671, LSG T671 LB T673, LV T673, LT T673, LW T673 LH T674 LS T676, LA T676, LO T676, LY T676, LB T676, LH T676, LSB T676, LW T676 LB T67C, LV T67C, LT T67C, LS T67K, LO T67K, LY T67K, LW E67C LS E67B, LA E67B, LO E67B, LY E67B, LB E67C, LV E67C, LT E67C LW T67C LS T679, LY T679, LG T679 LS T770, LO T770, LY T770, LG T770, LP T770 LB T773, LV T773, LT T773, LW T773 LH T774 LS E675, LA E675, LY E675, LS T675 LS T776, LA T776, LO T776, LY T776, LB T776 LHGB T686 LT T68C, LB T68C - Hyper Mini TOPLED® LB M676 - Mini TOPLED Santana® LG M470 LS M47K, LO M47K, LY M47K Source: http://www.osram.convergy.de LUXEON: - LUMILED® LXK2-PW12-R00, LXK2-PW12-S00, LXK2-PW14-U00, LXK2-PW14-V00 LXK2-PM12-R00, LXK2-PM12-S00, LXK2-PM14-U00 LXK2-PE12-Q00, LXK2-PE12-R00, LXK2-PE12-S00, LXK2-PE14-T00, LXK2-PE14-U00 LXK2-PB12-K00, LXK2-PB12-L00, LXK2-PB12-M00, LXK2-PB14-N00, LXK2-PB14-P00, LXK2-PB14-Q00 LXK2-PR12-L00, LXK2-PR12-M00, LXK2-PR14-Q00, LXK2-PR14-R00 LXK2-PD12-Q00, LXK2-PD12-R00, LXK2-PD12-S00 LXK2-PH12-R00, LXK2-PH12-S00 LXK2-PL12-P00, LXK2-PL12-Q00, LXK2-PL12-R00 Source: www.luxeon.com KINGBRIGHT: KA-3528ASYC Source: www.kingbright.com; COLOR: RD
LED4 = led:LED: LED OSRAM: - CHIPLED LG R971, LG N971, LY N971, LG Q971, LY Q971, LO R971, LY R971 LH N974, LH R974 LS Q976, LO Q976, LY Q976 LO Q996 - Hyper CHIPLED LW Q18S LB Q993, LB Q99A, LB R99A - SideLED LS A670, LO A670, LY A670, LG A670, LP A670 LB A673, LV A673, LT A673, LW A673 LH A674 LY A675 LS A676, LA A676, LO A676, LY A676, LW A676 LS A679, LY A679, LG A679 - Hyper Micro SIDELED® LS Y876, LA Y876, LO Y876, LY Y876 LT Y87S - SmartLED LW L88C, LW L88S LB L89C, LB L89S, LG L890 LS L89K, LO L89K, LY L89K LS L896, LA L896, LO L896, LY L896 - TOPLED LS T670, LO T670, LY T670, LG T670, LP T670 LSG T670, LSP T670, LSY T670, LOP T670, LYG T670 LG T671, LOG T671, LSG T671 LB T673, LV T673, LT T673, LW T673 LH T674 LS T676, LA T676, LO T676, LY T676, LB T676, LH T676, LSB T676, LW T676 LB T67C, LV T67C, LT T67C, LS T67K, LO T67K, LY T67K, LW E67C LS E67B, LA E67B, LO E67B, LY E67B, LB E67C, LV E67C, LT E67C LW T67C LS T679, LY T679, LG T679 LS T770, LO T770, LY T770, LG T770, LP T770 LB T773, LV T773, LT T773, LW T773 LH T774 LS E675, LA E675, LY E675, LS T675 LS T776, LA T776, LO T776, LY T776, LB T776 LHGB T686 LT T68C, LB T68C - Hyper Mini TOPLED® LB M676 - Mini TOPLED Santana® LG M470 LS M47K, LO M47K, LY M47K Source: http://www.osram.convergy.de LUXEON: - LUMILED® LXK2-PW12-R00, LXK2-PW12-S00, LXK2-PW14-U00, LXK2-PW14-V00 LXK2-PM12-R00, LXK2-PM12-S00, LXK2-PM14-U00 LXK2-PE12-Q00, LXK2-PE12-R00, LXK2-PE12-S00, LXK2-PE14-T00, LXK2-PE14-U00 LXK2-PB12-K00, LXK2-PB12-L00, LXK2-PB12-M00, LXK2-PB14-N00, LXK2-PB14-P00, LXK2-PB14-Q00 LXK2-PR12-L00, LXK2-PR12-M00, LXK2-PR14-Q00, LXK2-PR14-R00 LXK2-PD12-Q00, LXK2-PD12-R00, LXK2-PD12-S00 LXK2-PH12-R00, LXK2-PH12-S00 LXK2-PL12-P00, LXK2-PL12-Q00, LXK2-PL12-R00 Source: www.luxeon.com KINGBRIGHT: KA-3528ASYC Source: www.kingbright.com; COLOR: YE
LED5 LED6 = led:LED: LED OSRAM: - CHIPLED LG R971, LG N971, LY N971, LG Q971, LY Q971, LO R971, LY R971 LH N974, LH R974 LS Q976, LO Q976, LY Q976 LO Q996 - Hyper CHIPLED LW Q18S LB Q993, LB Q99A, LB R99A - SideLED LS A670, LO A670, LY A670, LG A670, LP A670 LB A673, LV A673, LT A673, LW A673 LH A674 LY A675 LS A676, LA A676, LO A676, LY A676, LW A676 LS A679, LY A679, LG A679 - Hyper Micro SIDELED® LS Y876, LA Y876, LO Y876, LY Y876 LT Y87S - SmartLED LW L88C, LW L88S LB L89C, LB L89S, LG L890 LS L89K, LO L89K, LY L89K LS L896, LA L896, LO L896, LY L896 - TOPLED LS T670, LO T670, LY T670, LG T670, LP T670 LSG T670, LSP T670, LSY T670, LOP T670, LYG T670 LG T671, LOG T671, LSG T671 LB T673, LV T673, LT T673, LW T673 LH T674 LS T676, LA T676, LO T676, LY T676, LB T676, LH T676, LSB T676, LW T676 LB T67C, LV T67C, LT T67C, LS T67K, LO T67K, LY T67K, LW E67C LS E67B, LA E67B, LO E67B, LY E67B, LB E67C, LV E67C, LT E67C LW T67C LS T679, LY T679, LG T679 LS T770, LO T770, LY T770, LG T770, LP T770 LB T773, LV T773, LT T773, LW T773 LH T774 LS E675, LA E675, LY E675, LS T675 LS T776, LA T776, LO T776, LY T776, LB T776 LHGB T686 LT T68C, LB T68C - Hyper Mini TOPLED® LB M676 - Mini TOPLED Santana® LG M470 LS M47K, LO M47K, LY M47K Source: http://www.osram.convergy.de LUXEON: - LUMILED® LXK2-PW12-R00, LXK2-PW12-S00, LXK2-PW14-U00, LXK2-PW14-V00 LXK2-PM12-R00, LXK2-PM12-S00, LXK2-PM14-U00 LXK2-PE12-Q00, LXK2-PE12-R00, LXK2-PE12-S00, LXK2-PE14-T00, LXK2-PE14-U00 LXK2-PB12-K00, LXK2-PB12-L00, LXK2-PB12-M00, LXK2-PB14-N00, LXK2-PB14-P00, LXK2-PB14-Q00 LXK2-PR12-L00, LXK2-PR12-M00, LXK2-PR14-Q00, LXK2-PR14-R00 LXK2-PD12-Q00, LXK2-PD12-R00, LXK2-PD12-S00 LXK2-PH12-R00, LXK2-PH12-S00 LXK2-PL12-P00, LXK2-PL12-Q00, LXK2-PL12-R00 Source: www.luxeon.com KINGBRIGHT: KA-3528ASYC Source: www.kingbright.com
OK1 OK3 = optocoupler:4N35: MOTOROLA OPTO COUPLER; FARNELL: 1612454; MF: FAIRCHILD SEMICONDUCTOR; MPN: 4N35; OC_FARNELL: 1328375; OC_NEWARK: 72K9946
Q1 = transistor-power:P-MOSFET-SO8: P-Channel MOSFET Example: FDS4435A; P-Channel Logic Level PowerTrench® MOSFET FDS4465; P-Channel 1.8V Specified PowerTrench® MOSFET Source: www.fairchildsemi.com
Q2-Q6 = transistor-pnp:BC857*: PNP Transistror; FARNELL: 8734771
R1-R6 R8 R9 R22 R30 R31 = rcl:R-EU_: RESISTOR, European symbol
R10 R11 R18 = resistor:R-EU_: RESISTOR, European symbol; FARNELL: 2498051
R12 R13 R19 = resistor:R-EU_: RESISTOR, European symbol; FARNELL: 2498057
R14 R16 = resistor:R-EU_: RESISTOR, European symbol; FARNELL: 2498090
R15 R17 = resistor:R-EU_: RESISTOR, European symbol; FARNELL: 2502672
R20 = resistor:R-EU_: RESISTOR, European symbol; FARNELL: 2498050
S1 = switch-omron:31-XX: OMRON SWITCH; MPN: B3F-3100; OC_FARNELL: 959704; OC_NEWARK: 36M3582
SV1 = con-lstb:MA05-2W
SV4 SV6 = con-lstb:MA04-2: PIN HEADER; OC_FARNELL: unknown; OC_NEWARK: unknown
SV5 = con-ml:ML14L: HARTING; OC_FARNELL: unknown; OC_NEWARK: unknown
T4 = transistor:BC847: NPN TRANSISTOR; FARNELL: 1081230
X1 X5 = con-riacon_akl:AKL18X-10: Riacon AKL18X Steckverbinder 10-Pol Grid = 3,5mm
X2 = con-cypressindustries:MINI-USB-: MINI USB-B Conector Source: www.cypressindustries.com; OC_FARNELL: unknown; OC_NEWARK: unknown
X3 X7 = con-riacon_akl:AKL18X-04: Riacon AKL18X Steckverbinder 4-Pol Grid = 3,5mm
X4 = con-subd:M09HP: SUB-D; OC_FARNELL: unknown; OC_NEWARK: unknown
X6 = con-riacon_akl:AKL18X-03: Riacon AKL18X Steckverbinder 3-Pol Grid = 3,5mm
X8-X12 X14 = AllSerial:ALLSERIAL

## Board
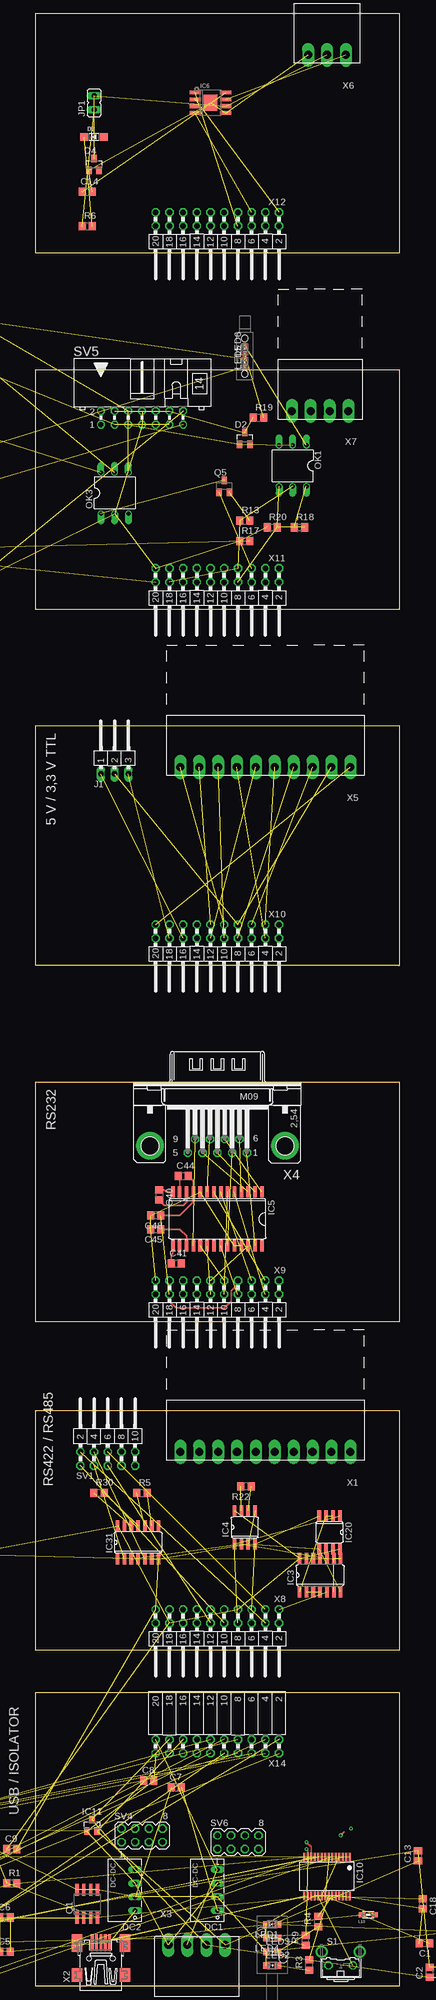
[diagram p6: board, top side]
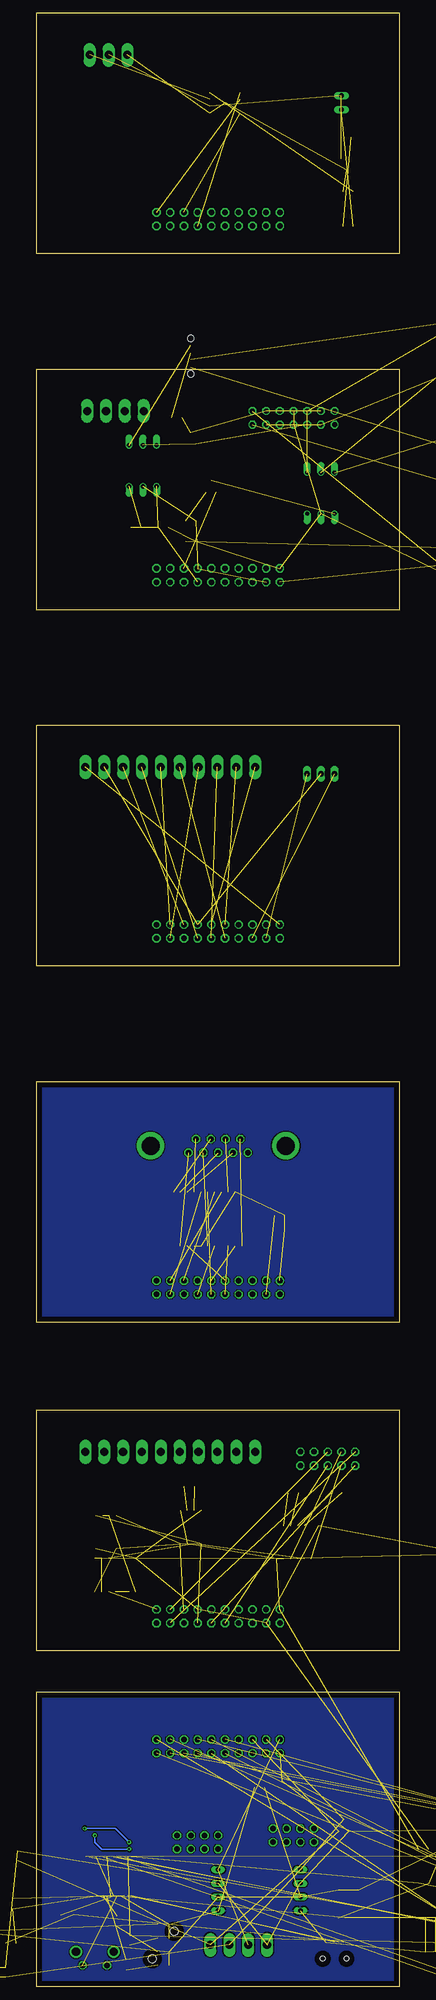
[diagram p7: board, bottom side, seen from below]

Size 67.4 x 365.81 mm. Coordinates in mm from the lower left corner, seen from the top.
Outline: 67.31,189.23 67.4,189.23
Copper layers (1*16): Top 0.035mm / dielectric 1.5mm / Bottom 0.035mm
Design rules "default *": minimum track width 10mil, minimum drill 24mil, track to track 8mil, track to pad 8mil, pad to pad 8mil, via to via 8mil, smd to smd 8mil, copper to edge 40mil, drill to drill 8mil, minimum pad ring 10mil, minimum via ring 8mil, stop-mask expansion 4mil, vias tented up to drill 0.3mm, thermal gap 10mil

### Footprints (pad centres in the part's own frame; a part is rotated, then mirrored left to right if it is on the bottom)
C0805 = smd 1.3 x 1.5: 1 -0.95,0; 2 0.95,0
SOT23 = smd 1 x 1.4: 1 -0.95,-1.1; 2 0.95,-1.1; 3 0,1.1
SOD-123 = smd 1.4 x 1.4: A 1.85,0; C -1.85,0
NME = drill 0.813 long: 1 0,3.81; 2 0,1.27; 3 0,-1.27; 4 0,-3.81
SO14 = smd 0.66 x 2.032: 1 -3.81,-3.073; 2 -2.54,-3.073; 3 -1.27,-3.073; 4 0,-3.073; 5 1.27,-3.073; 6 2.54,-3.073; 7 3.81,-3.073; 8 3.81,3.073; 9 2.54,3.073; 10 1.27,3.073; 11 0,3.073; 12 -1.27,3.073; 13 -2.54,3.073; 14 -3.81,3.073
SO08 = smd 0.66 x 2.032: 1 -1.905,-3.073; 2 -0.635,-3.073; 3 0.635,-3.073; 4 1.905,-3.073; 5 1.905,3.073; 6 0.635,3.073; 7 -0.635,3.073; 8 -1.905,3.073
SO28L = smd 0.66 x 2.032: 1 -8.255,-5.029; 2 -6.985,-5.029; 3 -5.715,-5.029; 4 -4.445,-5.029; 5 -3.175,-5.029; 6 -1.905,-5.029; 7 -0.635,-5.029; 8 0.635,-5.029; 9 1.905,-5.029; 10 3.175,-5.029; 11 4.445,-5.029; 12 5.715,-5.029; 13 6.985,-5.029; 14 8.255,-5.029; 15 8.255,5.029; 16 6.985,5.029; 17 5.715,5.029; 18 4.445,5.029; 19 3.175,5.029; 20 1.905,5.029; 21 0.635,5.029; 22 -0.635,5.029; 23 -1.905,5.029; 24 -3.175,5.029; 25 -4.445,5.029; 26 -5.715,5.029; 27 -6.985,5.029; 28 -8.255,5.029
SOIC8T = smd 2.032 x 0.66: 1 -2.794,1.905; 2 -2.794,0.635; 3 -2.794,-0.635; 4 -2.794,-1.905; 5 2.794,-1.905; 6 2.794,-0.635; 7 2.794,0.635; 8 2.794,1.905 | smd 2.489 x 2.997: TGND 0,0
SO16 = smd 0.6 x 2.2: 1 -4.445,-2.6; 2 -3.175,-2.6; 3 -1.905,-2.6; 4 -0.635,-2.6; 5 0.635,-2.6; 6 1.905,-2.6; 7 3.175,-2.6; 8 4.445,-2.6; 9 4.445,2.6; 10 3.175,2.6; 11 1.905,2.6; 12 0.635,2.6; 13 -0.635,2.6; 14 -1.905,2.6; 15 -3.175,2.6; 16 -4.445,2.6
SSOP28 = smd 0.4 x 1.5: 1 -4.225,-3.625; 2 -3.575,-3.625; 3 -2.925,-3.625; 4 -2.275,-3.625; 5 -1.625,-3.625; 6 -0.975,-3.625; 7 -0.325,-3.625; 8 0.325,-3.625; 9 0.975,-3.625; 10 1.625,-3.625; 11 2.275,-3.625; 12 2.925,-3.625; 13 3.575,-3.625; 14 4.225,-3.625; 15 4.225,3.625; 16 3.575,3.625; 17 2.925,3.625; 18 2.275,3.625; 19 1.625,3.625; 20 0.975,3.625; 21 0.325,3.625; 22 -0.325,3.625; 23 -0.975,3.625; 24 -1.625,3.625; 25 -2.275,3.625; 26 -2.925,3.625; 27 -3.575,3.625; 28 -4.225,3.625
MA03-1W = drill 1.016 long: 1 -2.54,0; 2 0,0; 3 2.54,0
JP1 = drill 0.914 long: 1 0,-1.27; 2 0,1.27
0805 = smd 1.2 x 1: 1 -1.2,0; 2 1.2,0
CHIPLED_0805 = smd 1.2 x 1.2: A 0,-1.05; C 0,1.05
CHIPLED_0603 = smd 0.8 x 0.8: A 0,-0.75; C 0,0.75
DIL06 = drill 0.813 offset: 1 -2.54,-3.81; 2 0,-3.81; 3 2.54,-3.81; 4 2.54,3.81; 5 0,3.81; 6 -2.54,3.81
SO-08 = smd 0.6 x 2.2: 1 -1.905,-2.6; 2 -0.635,-2.6; 3 0.635,-2.6; 4 1.905,-2.6; 5 1.905,2.6; 6 0.635,2.6; 7 -0.635,2.6; 8 -1.905,2.6
SOT23-BEC = smd 1 x 1.4: B -0.95,-1.1; C 0,1.1; E 0.95,-1.1
R0805 = smd 1.3 x 1.5: 1 -0.95,0; 2 0.95,0
B3F-31XX = drill 1.016 octagon: 1 -2.261,-1.245; 2 2.261,-1.245 | drill 1.499 pad 2.159: 3 -3.505,1.245; 4 3.505,1.245
MA05-2W = drill 1.016 octagon: 1 -5.08,-2.54; 2 -5.08,0; 3 -2.54,-2.54; 4 -2.54,0; 5 0,-2.54; 6 0,0; 7 2.54,-2.54; 8 2.54,0; 9 5.08,-2.54; 10 5.08,0
MA04-2 = drill 1.016 octagon: 1 -3.81,-1.27; 2 -3.81,1.27; 3 -1.27,-1.27; 4 -1.27,1.27; 5 1.27,-1.27; 6 1.27,1.27; 7 3.81,-1.27; 8 3.81,1.27
ML14L = drill 0.914 octagon: 1 -7.62,-1.27; 2 -7.62,1.27; 3 -5.08,-1.27; 4 -5.08,1.27; 5 -2.54,-1.27; 6 -2.54,1.27; 7 0,-1.27; 8 0,1.27; 9 2.54,-1.27; 10 2.54,1.27; 11 5.08,-1.27; 12 5.08,1.27; 13 7.62,-1.27; 14 7.62,1.27
1296.1004 = hole 1.5: 2.05,-2.54; -2.05,2.54
1296.2012 = hole 1.2: 0,3.3; 0,-3.3
AKL182-10 = drill 1.5 pad 2.184 long: P$1 -15.75,0; P$2 -12.25,0; P$3 -8.75,0; P$4 -5.25,0; P$5 -1.75,0; P$6 1.75,0; P$7 5.25,0; P$8 8.75,0; P$9 12.25,0; P$10 15.75,0
32005-201 = smd 3.1 x 0.5: 1 3,1.6; 2 3,0.8; 3 3,0; 4 3,-0.8; 5 3,-1.6 | smd 2.5 x 2: M1 -3,-4.45; M2 -3,4.45 | smd 3.3 x 2: M3 2.9,4.45; M4 2.9,-4.45 | hole 0.9: 0,2.2; 0,-2.2
AKL182-04 = drill 1.5 pad 2.184 long: P$1 -5.25,0; P$2 -1.75,0; P$3 1.75,0; P$4 5.25,0
M09HP = drill 1.016 octagon: 1 -5.486,1.27; 2 -2.743,1.27; 3 0,1.27; 4 2.743,1.27; 5 5.486,1.27; 6 -4.115,-1.27; 7 -1.372,-1.27; 8 1.372,-1.27; 9 4.115,-1.27 | drill 3.302 pad 5.08: G1 -12.522,0; G2 12.522,0
AKL182-03 = drill 1.5 pad 2.184 long: P$1 -3.5,0; P$2 0,0; P$3 3.5,0
DAUGHTER-THT = drill 1.016 octagon: 1 11.43,7.62; 2 11.43,5.08; 3 8.89,7.62; 4 8.89,5.08; 5 6.35,7.62; 6 6.35,5.08; 7 3.81,7.62; 8 3.81,5.08; 9 1.27,7.62; 10 1.27,5.08; 11 -1.27,7.62; 12 -1.27,5.08; 13 -3.81,7.62; 14 -3.81,5.08; 15 -6.35,7.62; 16 -6.35,5.08; 17 -8.89,7.62; 18 -8.89,5.08; 19 -11.43,7.62; 20 -11.43,5.08
MAIN-THT = drill 1.016 octagon: 1 11.43,43.18; 2 11.43,45.72; 3 8.89,43.18; 4 8.89,45.72; 5 6.35,43.18; 6 6.35,45.72; 7 3.81,43.18; 8 3.81,45.72; 9 1.27,43.18; 10 1.27,45.72; 11 -1.27,43.18; 12 -1.27,45.72; 13 -3.81,43.18; 14 -3.81,45.72; 15 -6.35,43.18; 16 -6.35,45.72; 17 -8.89,43.18; 18 -8.89,45.72; 19 -11.43,43.18; 20 -11.43,45.72

### Placement (x,y rotation side)
C1  72.12,7.94 180 top  (outside the outline)
C2  73.07,2.54 90 top  (outside the outline)
C3  78.15,2.54 90 top  (outside the outline)
C4  -9.48,26.67 0 top  (outside the outline)
C5  -5.67,6.35 0 top  (outside the outline)
C6  -5.67,12.7 0 top  (outside the outline)
C7  26.08,36.83 0 top
C8  21,38.1 0 top
C9  -4.4,25.4 0 top  (outside the outline)
C10  -12.02,80.01 0 top  (outside the outline)
C11  -12.02,102.87 0 top  (outside the outline)
C12  -12.02,92.71 0 top  (outside the outline)
C13  70.9,24.13 90 top  (outside the outline)
C14  9.57,332.74 0 top
C15  -46.31,34.29 0 top  (outside the outline)
C16  -46.31,27.94 0 top  (outside the outline)
C17  -46.31,21.59 0 top  (outside the outline)
C18  71.8,15.24 270 top  (outside the outline)
C19  -46.31,15.24 0 top  (outside the outline)
C40  22.91,146.69 270 top
C41  26.08,133.99 0 top
C44  27.37,150.21 0 top
C45  22.27,140.34 180 top
C48  22.27,142.88 180 top
D1  -33.61,285.75 0 top  (outside the outline)
D2  38.78,287.02 0 top
D3  10.84,342.9 0 top
D4  10.84,337.82 0 top
DC1  33.7,17.78 180 top
DC2  18.46,17.78 180 top
IC3  52.75,76.2 0 top
IC4  38.78,85.09 0 top
IC5  33.7,142.24 180 top
IC6  32.43,349.25 0 top
IC7  -28.53,26.67 0 top  (outside the outline)
IC8  -29.8,10.16 0 top  (outside the outline)
IC9  -28.53,-2.54 0 top  (outside the outline)
IC10  54.02,20.32 180 top
IC11  10.44,29.8 0 top
IC20  54.5,84.15 180 top
IC31  19,82.28 0 top
J1  14.65,224.79 0 top
JP1  10.84,349.25 0 top
L10  61.68,13.22 0 top
LED1  43.86,11.43 90 top
LED2  43.86,3.81 270 top
LED3  43.86,6.35 270 top
LED4  43.86,8.89 90 top
LED5  38.78,300.99 0 top
LED6  38.78,303.53 0 top
OK1  47.67,281.94 180 top
OK3  14.65,276.86 0 top
Q1  9.57,15.24 0 top
Q2  -33.61,270.51 0 top  (outside the outline)
Q3  -33.61,262.89 0 top  (outside the outline)
Q4  -33.61,241.3 0 top  (outside the outline)
Q5  34.97,278.13 0 top
Q6  -17.1,265.43 0 top  (outside the outline)
R1  -4.4,19.05 0 top  (outside the outline)
R2  -10.75,17.78 0 top  (outside the outline)
R3  50.76,3.88 90 top
R4  52.38,11.96 90 top
R5  19.73,91.44 0 top
R6  9.57,326.39 0 top
R8  78.15,10.16 0 top  (outside the outline)
R9  50.05,8.49 90 top
R10  -9.48,299.72 0 top  (outside the outline)
R11  -27.26,293.37 0 top  (outside the outline)
R12  -33.61,278.13 0 top  (outside the outline)
R13  38.78,271.78 0 top
R14  -33.61,255.27 0 top  (outside the outline)
R15  -33.61,248.92 0 top  (outside the outline)
R16  -25.99,233.68 0 top  (outside the outline)
R17  38.78,267.97 0 top
R18  48.94,270.51 0 top
R19  41.32,290.83 0 top
R20  43.86,270.51 0 top
R22  39.03,92.63 180 top
R30  11.75,91.49 0 top
R31  78.76,161.98 90 top  (outside the outline)
S1  56.56,5.08 0 top
SV1  13.38,99.06 0 top
SV4  19.73,27.94 0 top
SV5  19.73,290.83 0 top
SV6  37.51,26.67 0 top
T4  -8.21,307.34 0 top  (outside the outline)
U$3  [1296.1004]  43.86,7.62 180 top
U$7  [1296.2012]  38.78,302.26 0 top
X1  42.59,99.06 180 top
X2  12.11,5.08 90 top
X3  29.89,7.62 0 top
X4  33.7,155.8 180 top
X5  42.59,226.06 180 top
X6  54.02,358.14 180 top
X7  52.75,292.1 180 top
X8  33.7,62.23 0 top
X9  33.7,123.19 0 top
X10  33.7,189.23 0 top
X11  33.7,255.27 0 top
X12  33.7,321.31 0 top
X14  33.7,0 0 top

### Tracks (layer width: path | path; a pad name or v marks a point on that pad's centre or on a via)
!PWEN  (2 unrouted)
+3V3/1  (3 unrouted)
+5V  (18 unrouted)
+5V/1  (5 unrouted)
+5V/2  (9 unrouted)
+5V/3  (1 unrouted)
  Top 0.254: IC5.11 29.26,149.28 C44.2
  Top 0.305: X9.18 24.81,127 26.08,125.73 34.97,125.73 36.24,127 36.24,128.91 37.51,130.18 X9.7 | C48.1 26.72,142.88 29.26,145.41 IC5.11
+5V/5  (3 unrouted)
+12V/1  (2 unrouted)
+12V/5  (4 unrouted)
CC1  (1 unrouted)
CC2  (1 unrouted)
CTS4  (1 unrouted)
DCD4  (1 unrouted)
DSR4  (1 unrouted)
DTR4  (1 unrouted)
GND  (21 unrouted)
  pour Bottom: -0.59,0 68.55,0 68.55,55.22 -0.59,54.95
GND1  (17 unrouted)
GND2  (10 unrouted)
GND3  (5 unrouted)
  pour Bottom: -0.59,123.19 67.99,123.19 67.99,167.64 -0.59,167.64
GND4  (1 unrouted)
GND5  (6 unrouted)
GND6  (4 unrouted)
N$1  (1 unrouted)
N$2  (1 unrouted)
N$3  (via drill 0.3)  (2 unrouted)
  Top 0.305: IC10.13 50.45,25.16 v50.21,25.4 | 57.2,28.57 v56.56,27.94
  Bottom 0.305: v56.56,27.94 56.56,26.67 55.29,25.4 v50.21,25.4
N$4  (1 unrouted)
N$5  (1 unrouted)
N$6  (1 unrouted)
N$7  (1 unrouted)
N$8  (1 unrouted)
N$9  (1 unrouted)
N$10  (1 unrouted)
N$11  (2 unrouted)
N$12  (1 unrouted)
N$13  (via drill 0.3)  (1 unrouted)
  Top 0.305: IC10.12 51.09,25.79 v50.21,26.67
  Bottom 0.305: v58.47,29.21 52.75,29.21 v50.21,26.67
N$14  (1 unrouted)
N$15  (1 unrouted)
N$16  (1 unrouted)
N$17  (1 unrouted)
N$18  (1 unrouted)
N$19  (1 unrouted)
N$20  (1 unrouted)
N$21  (1 unrouted)
N$22  (1 unrouted)
N$23  (1 unrouted)
N$24  (1 unrouted)
N$25
  Top 0.305: C40.2 23.86,144.78 27.35,144.78 27.99,145.41 IC5.12
N$26
  Top 0.305: IC5.14 25.39,147.32 24.18,147.32 23.86,147.63 C40.1
N$27
  Top 0.305: C41.1 25.13,135.57 25.45,135.89 IC5.15
N$28
  Top 0.305: 27.03,135.57 26.72,135.89 IC5.16
N$29  (1 unrouted)
N$30
  Top 0.305: C45.1 26.72,140.34 27.99,139.06 IC5.17
N$31
  Top 0.254: IC5.13 26.72,149.91 C44.1
N$32  (1 unrouted)
N$33  (1 unrouted)
N$34  (1 unrouted)
N$35  (1 unrouted)
N$36  (1 unrouted)
N$37  (1 unrouted)
N$38  (8 unrouted)
N$39  (1 unrouted)
N$40  (1 unrouted)
N$41  (1 unrouted)
N$42  (2 unrouted)
N$43  (1 unrouted)
N$45  (2 unrouted)
N$46  (3 unrouted)
N$47  (1 unrouted)
N$48  (2 unrouted)
N$49  (2 unrouted)
N$50  (2 unrouted)
N$51  (2 unrouted)
N$52  (2 unrouted)
N$53  (2 unrouted)
N$54  (1 unrouted)
N$55  (2 unrouted)
N$56  (2 unrouted)
N$57  (2 unrouted)
N$58  (1 unrouted)
N$59  (2 unrouted)
N$60  (1 unrouted)
N$61  (1 unrouted)
N$62  (1 unrouted)
N$63  (1 unrouted)
N$64  (1 unrouted)
N$66  (1 unrouted)
N$67  (1 unrouted)
N$68  (1 unrouted)
N$69  (1 unrouted)
N$70  (1 unrouted)
N$71  (1 unrouted)
N$72  (1 unrouted)
N$73  (3 unrouted)
N$74  (1 unrouted)
N$75  (1 unrouted)
N$76  (1 unrouted)
N$77  (1 unrouted)
N$78  (1 unrouted)
N$79  (1 unrouted)
N$80  (1 unrouted)
N$81  (1 unrouted)
N$82  (1 unrouted)
N$83  (1 unrouted)
N$84  (1 unrouted)
N$85  (1 unrouted)
N$86  (1 unrouted)
N$87  (1 unrouted)
N$88  (1 unrouted)
N$89  (1 unrouted)
N$90  (2 unrouted)
N$91  (1 unrouted)
N$93  (1 unrouted)
N$94  (1 unrouted)
N$95  (1 unrouted)
N$96  (1 unrouted)
N$97  (1 unrouted)
N$98  (1 unrouted)
N$99  (1 unrouted)
N$100  (1 unrouted)
RI4  (1 unrouted)
RS422EN  (3 unrouted)
RTS4  (1 unrouted)
RXD4  (1 unrouted)
RXLED  (1 unrouted)
RXN  (2 unrouted)
RXP  (3 unrouted)
TXD4  (1 unrouted)
TXLED  (1 unrouted)
TXN  (3 unrouted)
TXP  (4 unrouted)
VIN1  (9 unrouted)

### Text on the board
tPlace: 5 V / 3,3 V TTL | RS232 | RS422 / RS485 | USB / ISOLATOR